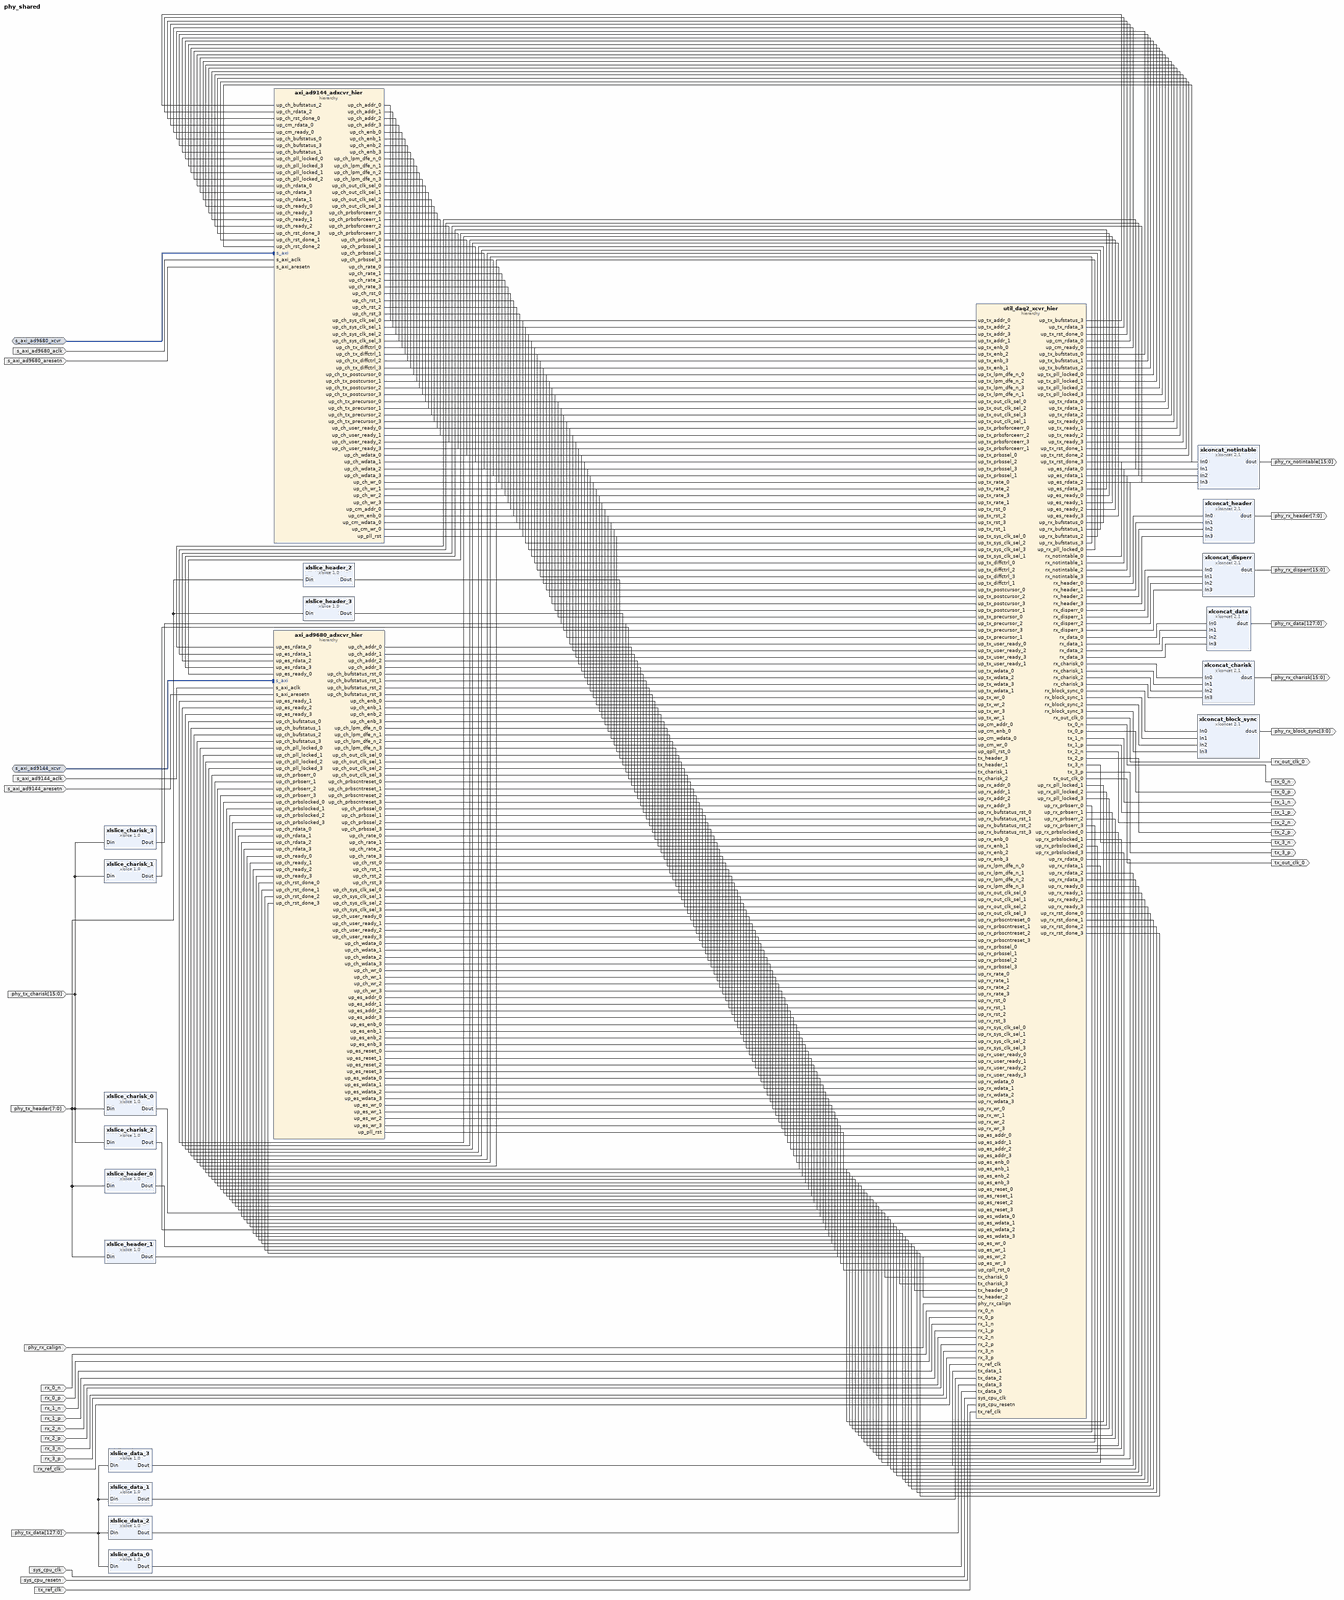
[diagram p0: block diagram of the top level, whole]
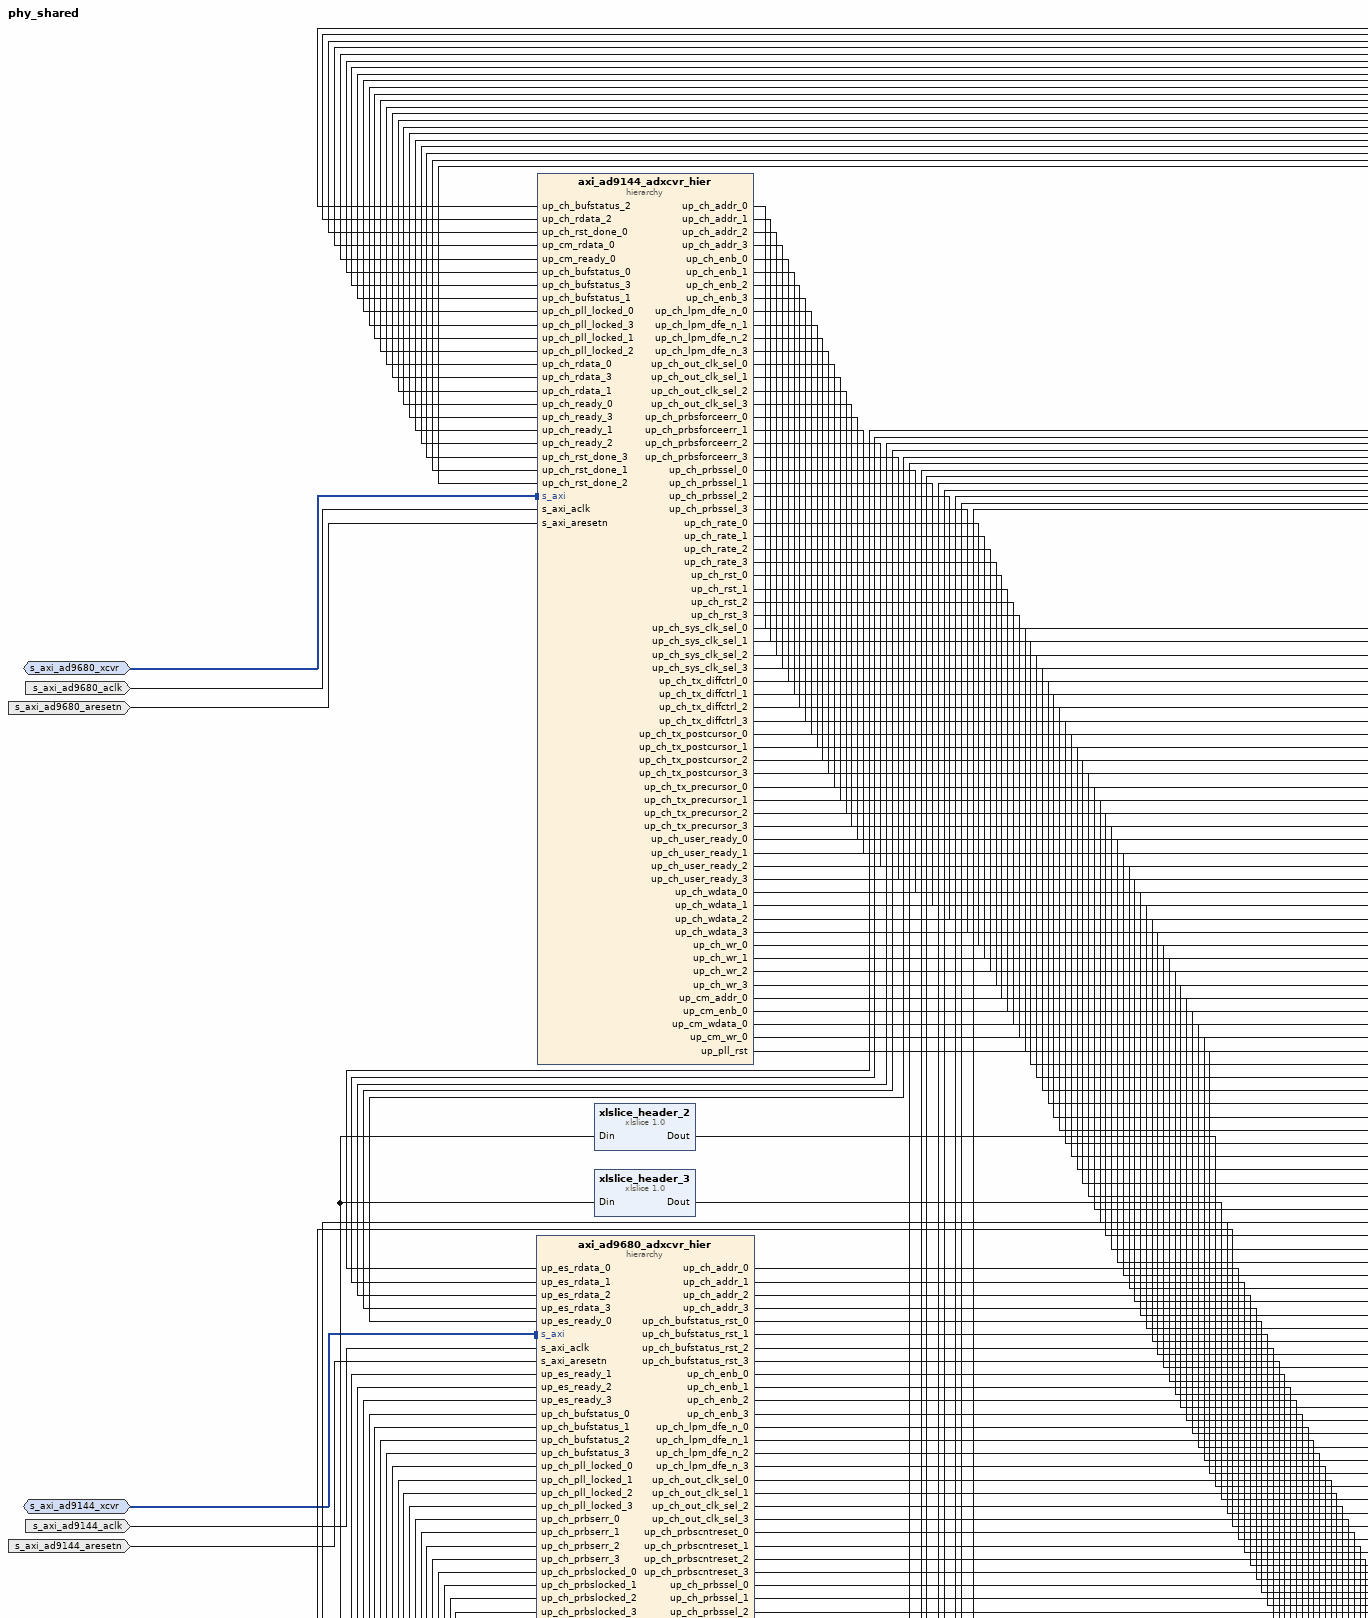
[diagram p1: block diagram of the top level, upper left part]
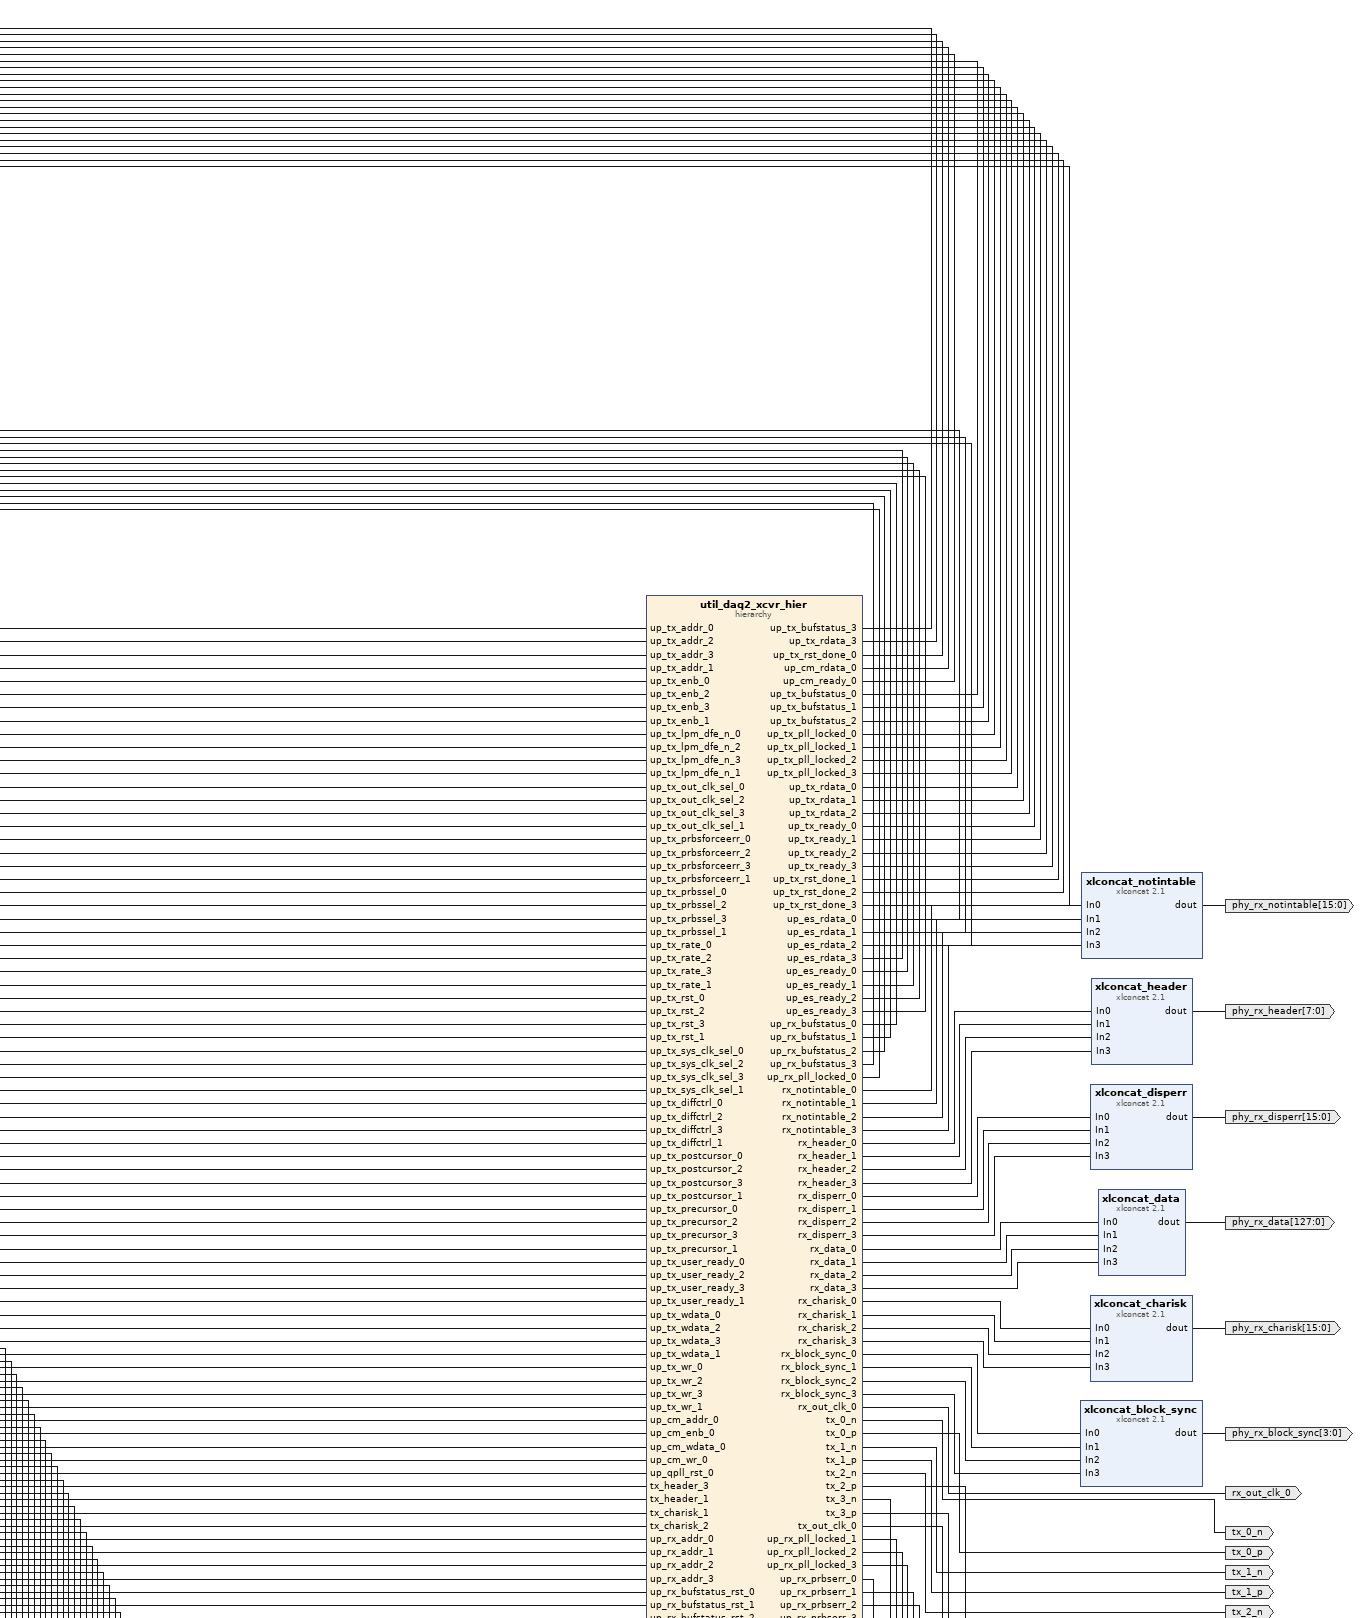
[diagram p2: block diagram of the top level, upper right part]
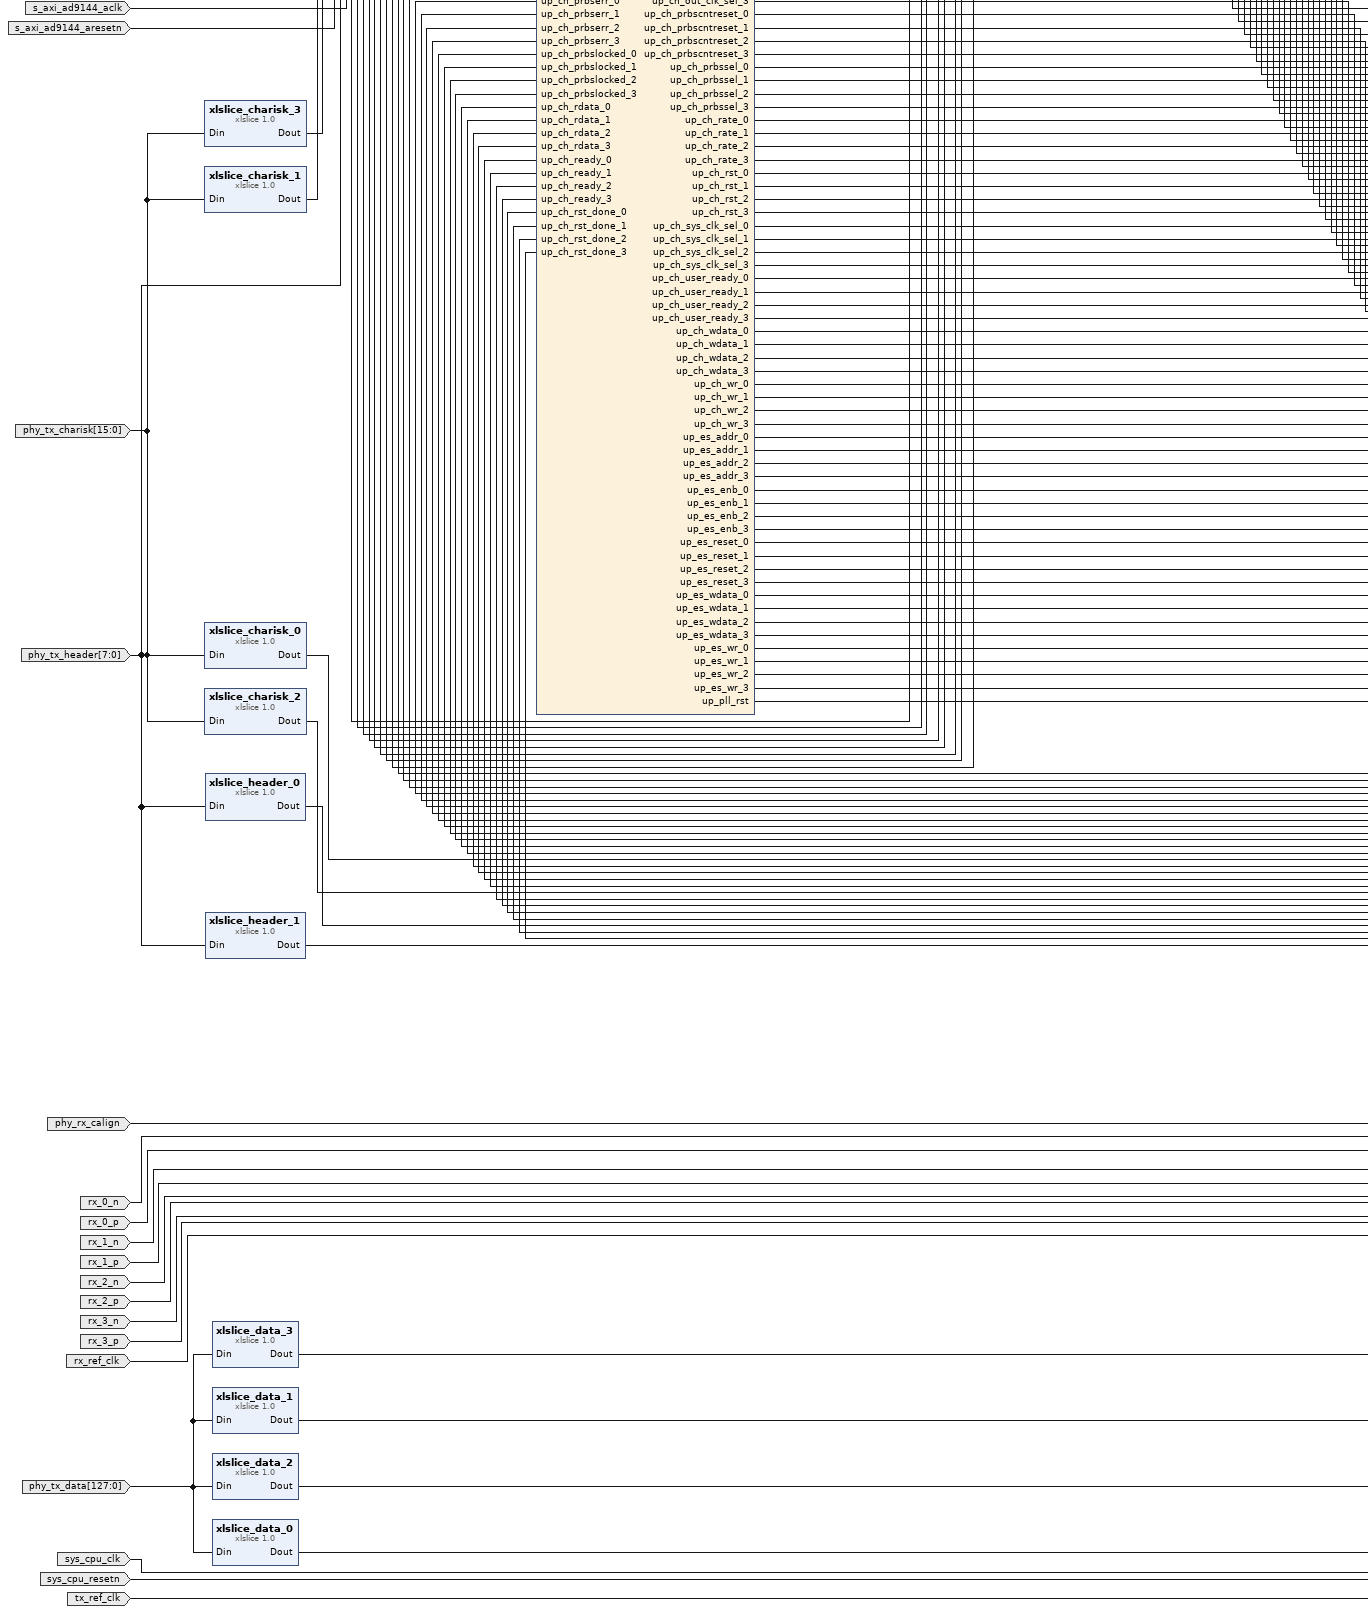
[diagram p3: block diagram of the top level, lower left part]
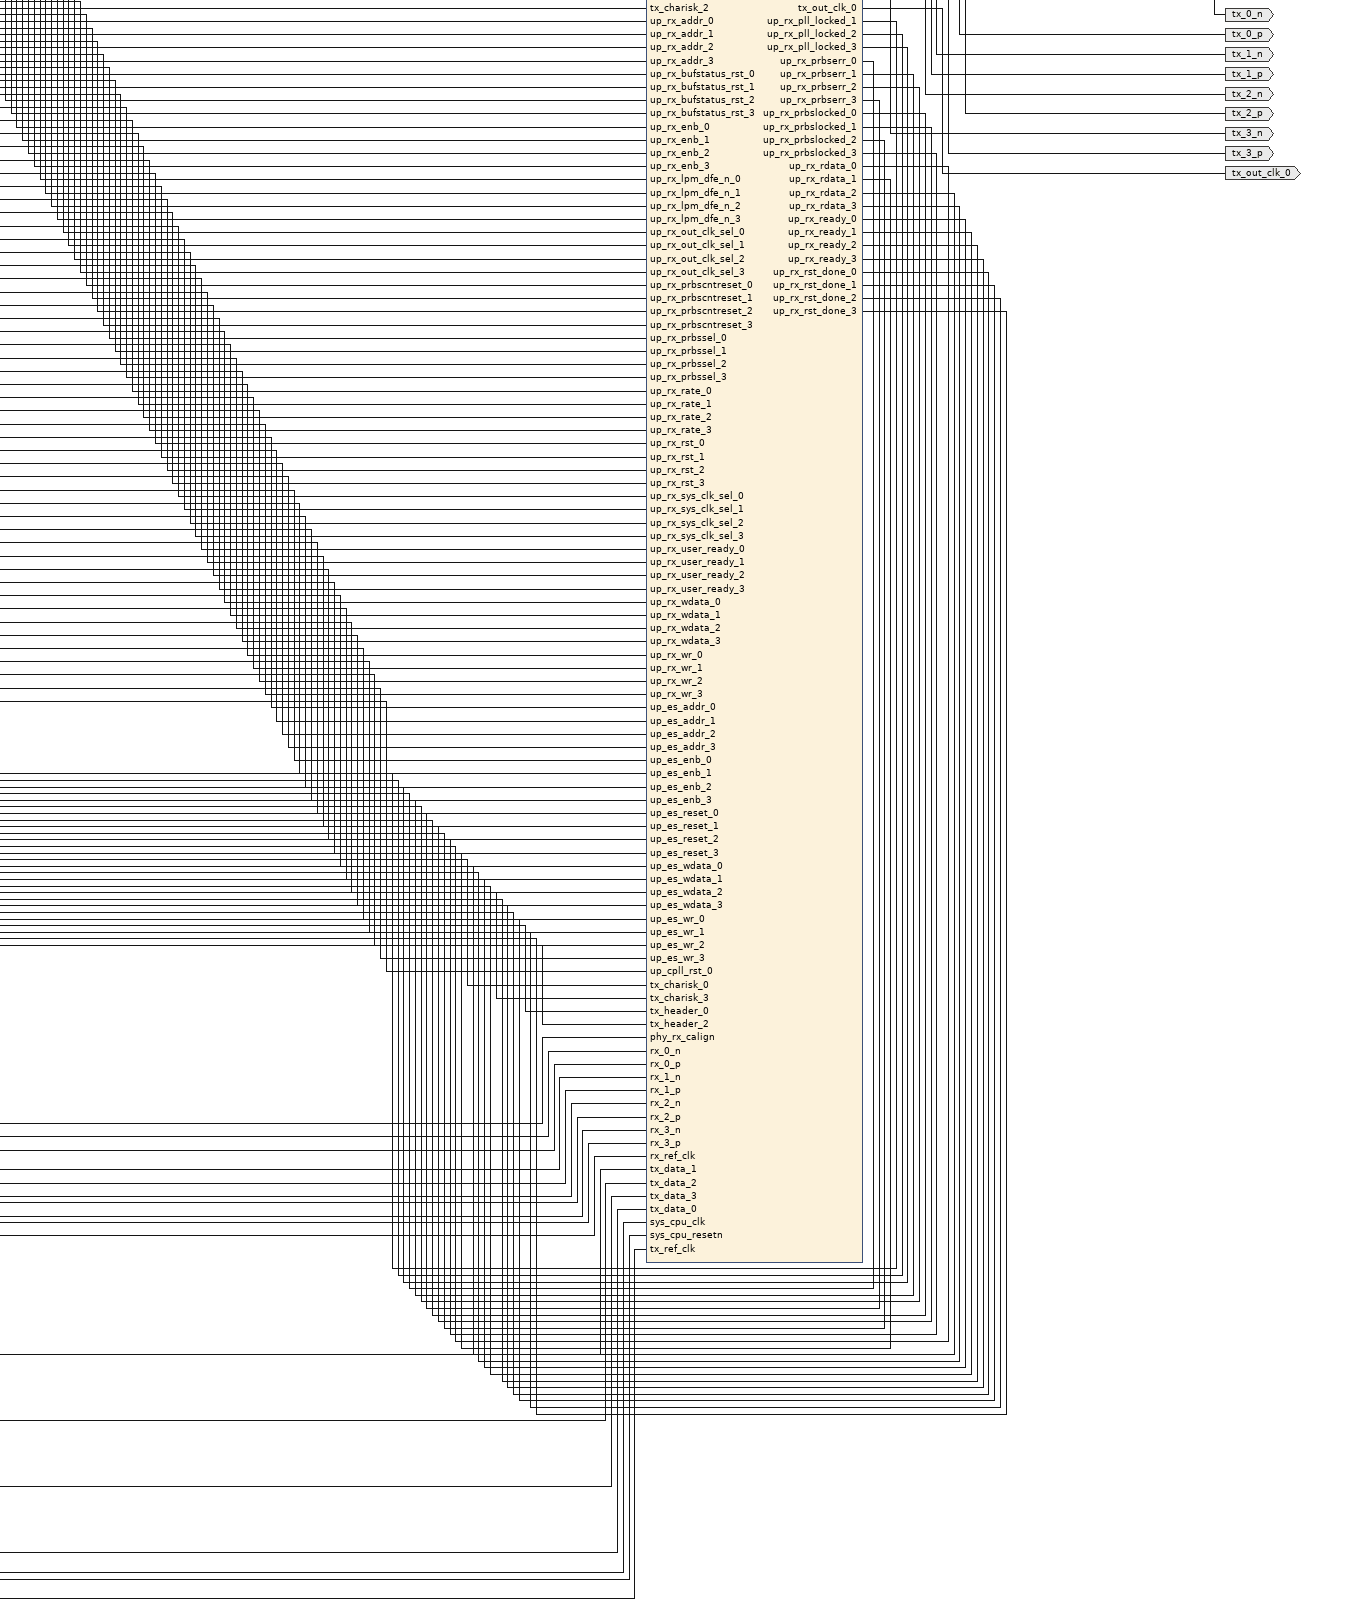
[diagram p4: block diagram of the top level, lower right part]
# Vivado block design phy_shared, xczu7ev-fbvb900-1-e, Vivado 2022.2
create_bd_design phy_shared

create_bd_intf_port -mode Slave -vlnv xilinx.com:interface:aximm_rtl:1.0 s_axi_ad9144_xcvr
set_property -dict [list \
  CONFIG.ADDR_WIDTH 16 \
  CONFIG.ARUSER_WIDTH 0 \
  CONFIG.AWUSER_WIDTH 0 \
  CONFIG.BUSER_WIDTH 0 \
  CONFIG.DATA_WIDTH 32 \
  CONFIG.HAS_BRESP 1 \
  CONFIG.HAS_BURST 0 \
  CONFIG.HAS_CACHE 0 \
  CONFIG.HAS_LOCK 0 \
  CONFIG.HAS_PROT 1 \
  CONFIG.HAS_QOS 0 \
  CONFIG.HAS_REGION 0 \
  CONFIG.HAS_RRESP 1 \
  CONFIG.HAS_WSTRB 1 \
  CONFIG.ID_WIDTH 0 \
  CONFIG.MAX_BURST_LENGTH 1 \
  CONFIG.NUM_READ_OUTSTANDING 1 \
  CONFIG.NUM_READ_THREADS 1 \
  CONFIG.NUM_WRITE_OUTSTANDING 1 \
  CONFIG.NUM_WRITE_THREADS 1 \
  CONFIG.PROTOCOL AXI4LITE \
  CONFIG.READ_WRITE_MODE READ_WRITE \
  CONFIG.RUSER_BITS_PER_BYTE 0 \
  CONFIG.RUSER_WIDTH 0 \
  CONFIG.SUPPORTS_NARROW_BURST 0 \
  CONFIG.WUSER_BITS_PER_BYTE 0 \
  CONFIG.WUSER_WIDTH 0 \
] [get_bd_intf_ports s_axi_ad9144_xcvr]
create_bd_intf_port -mode Slave -vlnv xilinx.com:interface:aximm_rtl:1.0 s_axi_ad9680_xcvr
set_property -dict [list \
  CONFIG.ADDR_WIDTH 16 \
  CONFIG.ARUSER_WIDTH 0 \
  CONFIG.AWUSER_WIDTH 0 \
  CONFIG.BUSER_WIDTH 0 \
  CONFIG.DATA_WIDTH 32 \
  CONFIG.HAS_BRESP 1 \
  CONFIG.HAS_BURST 0 \
  CONFIG.HAS_CACHE 0 \
  CONFIG.HAS_LOCK 0 \
  CONFIG.HAS_PROT 1 \
  CONFIG.HAS_QOS 0 \
  CONFIG.HAS_REGION 0 \
  CONFIG.HAS_RRESP 1 \
  CONFIG.HAS_WSTRB 1 \
  CONFIG.ID_WIDTH 0 \
  CONFIG.MAX_BURST_LENGTH 1 \
  CONFIG.NUM_READ_OUTSTANDING 1 \
  CONFIG.NUM_READ_THREADS 1 \
  CONFIG.NUM_WRITE_OUTSTANDING 1 \
  CONFIG.NUM_WRITE_THREADS 1 \
  CONFIG.PROTOCOL AXI4LITE \
  CONFIG.READ_WRITE_MODE READ_WRITE \
  CONFIG.RUSER_BITS_PER_BYTE 0 \
  CONFIG.RUSER_WIDTH 0 \
  CONFIG.SUPPORTS_NARROW_BURST 0 \
  CONFIG.WUSER_BITS_PER_BYTE 0 \
  CONFIG.WUSER_WIDTH 0 \
] [get_bd_intf_ports s_axi_ad9680_xcvr]
create_bd_port -dir O rx_out_clk_0
create_bd_port -dir O tx_out_clk_0
create_bd_port -dir I sys_cpu_resetn
create_bd_port -dir I sys_cpu_clk
create_bd_port -dir I tx_ref_clk
create_bd_port -dir I rx_ref_clk
create_bd_port -dir I rx_0_p
create_bd_port -dir I rx_0_n
create_bd_port -dir I phy_rx_calign
create_bd_port -dir O tx_0_p
create_bd_port -dir O tx_0_n
create_bd_port -dir O tx_1_p
create_bd_port -dir O tx_1_n
create_bd_port -dir O tx_3_p
create_bd_port -dir O tx_3_n
create_bd_port -dir O tx_2_p
create_bd_port -dir O tx_2_n
create_bd_port -dir I rx_3_p
create_bd_port -dir I rx_3_n
create_bd_port -dir I rx_2_p
create_bd_port -dir I rx_2_n
create_bd_port -dir I rx_1_p
create_bd_port -dir I rx_1_n
create_bd_port -dir O -from 15 -to 0 phy_rx_charisk
create_bd_port -dir O -from 127 -to 0 phy_rx_data
create_bd_port -dir O -from 15 -to 0 phy_rx_disperr
create_bd_port -dir O -from 15 -to 0 phy_rx_notintable
create_bd_port -dir O -from 3 -to 0 phy_rx_block_sync
create_bd_port -dir O -from 7 -to 0 phy_rx_header
create_bd_port -dir I s_axi_ad9144_aclk
create_bd_port -dir I s_axi_ad9144_aresetn
create_bd_port -dir I s_axi_ad9680_aclk
create_bd_port -dir I s_axi_ad9680_aresetn
create_bd_port -dir I -from 15 -to 0 phy_tx_charisk
create_bd_port -dir I -from 7 -to 0 phy_tx_header
create_bd_port -dir I -from 127 -to 0 phy_tx_data

create_bd_cell -type hier axi_ad9144_adxcvr_hier
create_bd_cell -type hier axi_ad9680_adxcvr_hier
create_bd_cell -type hier util_daq2_xcvr_hier
create_bd_cell -type ip -vlnv xilinx.com:ip:xlconcat:2.1 xlconcat_charisk
set_property -dict {CONFIG.NUM_PORTS 4} [get_bd_cells xlconcat_charisk]
create_bd_cell -type ip -vlnv xilinx.com:ip:xlconcat:2.1 xlconcat_data
set_property -dict {CONFIG.NUM_PORTS 4} [get_bd_cells xlconcat_data]
create_bd_cell -type ip -vlnv xilinx.com:ip:xlconcat:2.1 xlconcat_disperr
set_property -dict {CONFIG.NUM_PORTS 4} [get_bd_cells xlconcat_disperr]
create_bd_cell -type ip -vlnv xilinx.com:ip:xlconcat:2.1 xlconcat_notintable
set_property -dict {CONFIG.NUM_PORTS 4} [get_bd_cells xlconcat_notintable]
create_bd_cell -type ip -vlnv xilinx.com:ip:xlconcat:2.1 xlconcat_block_sync
set_property -dict {CONFIG.NUM_PORTS 4} [get_bd_cells xlconcat_block_sync]
create_bd_cell -type ip -vlnv xilinx.com:ip:xlconcat:2.1 xlconcat_header
set_property -dict {CONFIG.NUM_PORTS 4} [get_bd_cells xlconcat_header]
create_bd_cell -type ip -vlnv xilinx.com:ip:xlslice:1.0 xlslice_charisk_0
set_property -dict {CONFIG.DIN_FROM 3 CONFIG.DIN_WIDTH 16} [get_bd_cells xlslice_charisk_0]
create_bd_cell -type ip -vlnv xilinx.com:ip:xlslice:1.0 xlslice_charisk_1
set_property -dict {CONFIG.DIN_FROM 7 CONFIG.DIN_TO 4 CONFIG.DIN_WIDTH 16} [get_bd_cells xlslice_charisk_1]
create_bd_cell -type ip -vlnv xilinx.com:ip:xlslice:1.0 xlslice_charisk_2
set_property -dict {CONFIG.DIN_FROM 11 CONFIG.DIN_TO 8 CONFIG.DIN_WIDTH 16} [get_bd_cells xlslice_charisk_2]
create_bd_cell -type ip -vlnv xilinx.com:ip:xlslice:1.0 xlslice_charisk_3
set_property -dict {CONFIG.DIN_FROM 15 CONFIG.DIN_TO 12 CONFIG.DIN_WIDTH 16} [get_bd_cells xlslice_charisk_3]
create_bd_cell -type ip -vlnv xilinx.com:ip:xlslice:1.0 xlslice_header_0
set_property -dict {CONFIG.DIN_FROM 1 CONFIG.DIN_WIDTH 8} [get_bd_cells xlslice_header_0]
create_bd_cell -type ip -vlnv xilinx.com:ip:xlslice:1.0 xlslice_header_1
set_property -dict {CONFIG.DIN_FROM 3 CONFIG.DIN_TO 2 CONFIG.DIN_WIDTH 8} [get_bd_cells xlslice_header_1]
create_bd_cell -type ip -vlnv xilinx.com:ip:xlslice:1.0 xlslice_header_2
set_property -dict {CONFIG.DIN_FROM 5 CONFIG.DIN_TO 4 CONFIG.DIN_WIDTH 8} [get_bd_cells xlslice_header_2]
create_bd_cell -type ip -vlnv xilinx.com:ip:xlslice:1.0 xlslice_header_3
set_property -dict {CONFIG.DIN_FROM 7 CONFIG.DIN_TO 6 CONFIG.DIN_WIDTH 8} [get_bd_cells xlslice_header_3]
create_bd_cell -type ip -vlnv xilinx.com:ip:xlslice:1.0 xlslice_data_0
set_property -dict {CONFIG.DIN_FROM 31 CONFIG.DIN_WIDTH 128} [get_bd_cells xlslice_data_0]
create_bd_cell -type ip -vlnv xilinx.com:ip:xlslice:1.0 xlslice_data_1
set_property -dict {CONFIG.DIN_FROM 31 CONFIG.DIN_WIDTH 128} [get_bd_cells xlslice_data_1]
create_bd_cell -type ip -vlnv xilinx.com:ip:xlslice:1.0 xlslice_data_2
set_property -dict {CONFIG.DIN_FROM 31 CONFIG.DIN_WIDTH 128} [get_bd_cells xlslice_data_2]
create_bd_cell -type ip -vlnv xilinx.com:ip:xlslice:1.0 xlslice_data_3
set_property -dict {CONFIG.DIN_FROM 31 CONFIG.DIN_WIDTH 128} [get_bd_cells xlslice_data_3]

# ---- hierarchy /axi_ad9144_adxcvr_hier ----
current_bd_instance /axi_ad9144_adxcvr_hier
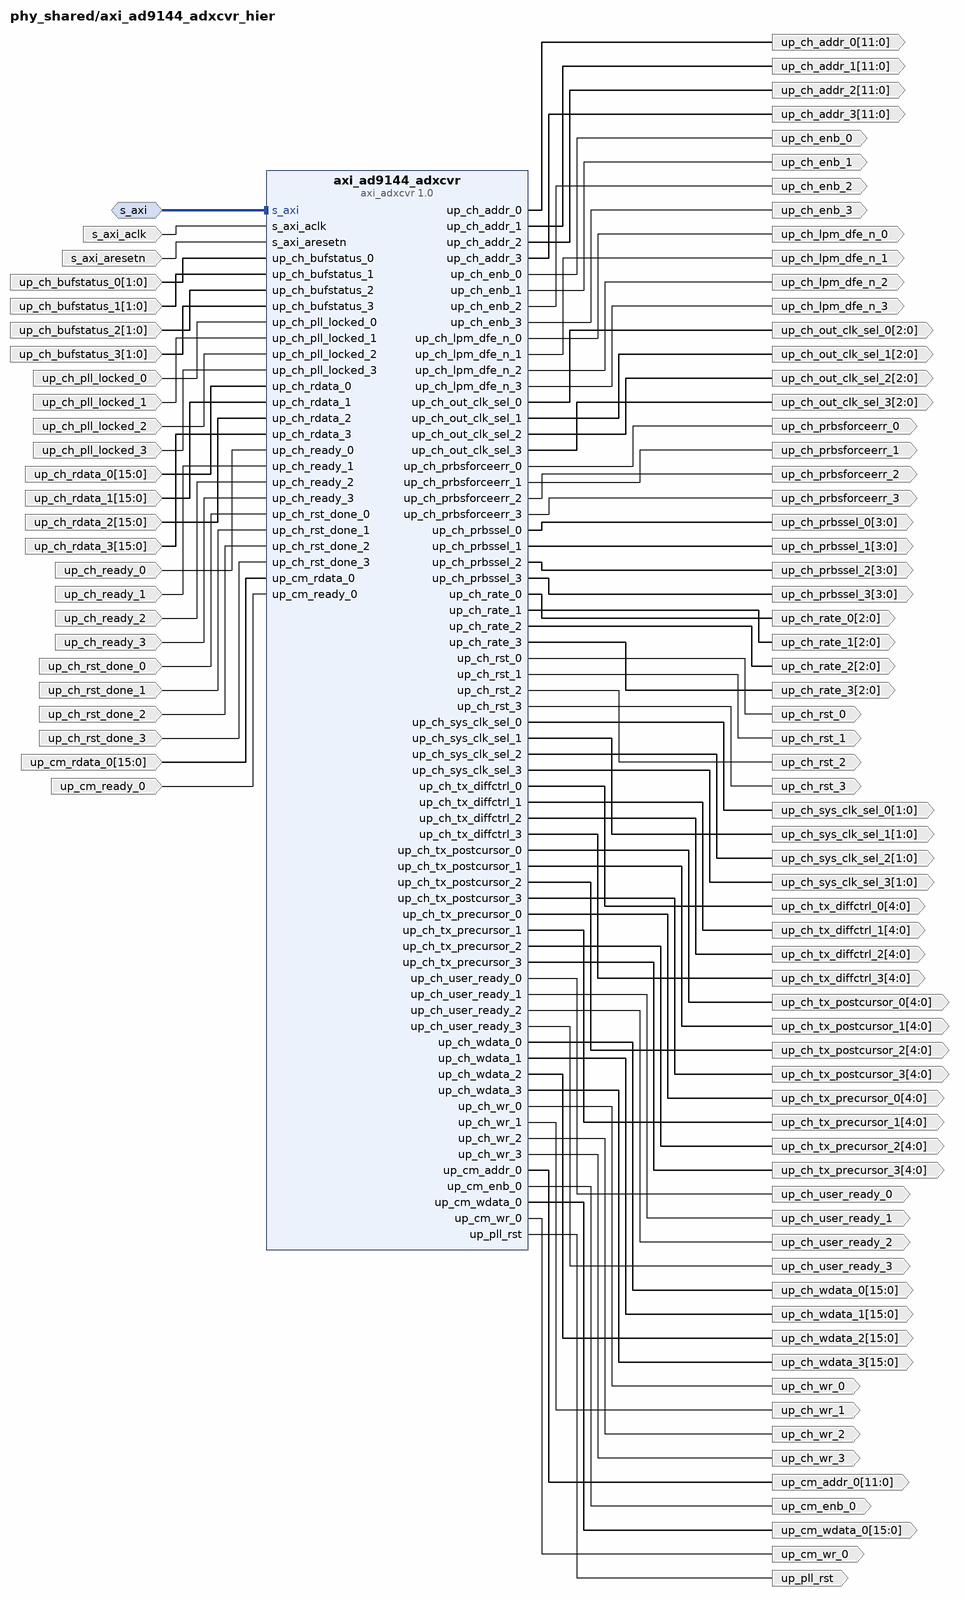
[diagram p5: block diagram inside /axi_ad9144_adxcvr_hier]
create_bd_intf_pin -mode Slave -vlnv xilinx.com:interface:aximm_rtl:1.0 s_axi
create_bd_pin -dir I up_ch_rst_done_0
create_bd_pin -dir I up_ch_pll_locked_0
create_bd_pin -dir I -from 1 -to 0 up_ch_bufstatus_0
create_bd_pin -dir I -from 15 -to 0 up_ch_rdata_0
create_bd_pin -dir I up_ch_ready_0
create_bd_pin -dir I up_ch_pll_locked_3
create_bd_pin -dir I up_ch_rst_done_3
create_bd_pin -dir I -from 1 -to 0 up_ch_bufstatus_3
create_bd_pin -dir I -from 15 -to 0 up_ch_rdata_3
create_bd_pin -dir I up_ch_ready_3
create_bd_pin -dir I up_ch_pll_locked_1
create_bd_pin -dir I up_ch_rst_done_1
create_bd_pin -dir I -from 1 -to 0 up_ch_bufstatus_1
create_bd_pin -dir I -from 15 -to 0 up_ch_rdata_1
create_bd_pin -dir I up_ch_ready_1
create_bd_pin -dir I up_ch_pll_locked_2
create_bd_pin -dir I -from 1 -to 0 up_ch_bufstatus_2
create_bd_pin -dir I -from 15 -to 0 up_ch_rdata_2
create_bd_pin -dir I up_ch_rst_done_2
create_bd_pin -dir I up_ch_ready_2
create_bd_pin -dir I -from 15 -to 0 up_cm_rdata_0
create_bd_pin -dir I up_cm_ready_0
create_bd_pin -dir I s_axi_aclk
create_bd_pin -dir I s_axi_aresetn
create_bd_pin -dir O up_cm_enb_0
create_bd_pin -dir O -from 11 -to 0 up_cm_addr_0
create_bd_pin -dir O up_cm_wr_0
create_bd_pin -dir O -from 15 -to 0 up_cm_wdata_0
create_bd_pin -dir O up_ch_rst_0
create_bd_pin -dir O up_ch_user_ready_0
create_bd_pin -dir O up_ch_prbsforceerr_0
create_bd_pin -dir O -from 3 -to 0 up_ch_prbssel_0
create_bd_pin -dir O up_ch_lpm_dfe_n_0
create_bd_pin -dir O -from 2 -to 0 up_ch_rate_0
create_bd_pin -dir O -from 1 -to 0 up_ch_sys_clk_sel_0
create_bd_pin -dir O -from 2 -to 0 up_ch_out_clk_sel_0
create_bd_pin -dir O -from 4 -to 0 up_ch_tx_diffctrl_0
create_bd_pin -dir O -from 4 -to 0 up_ch_tx_postcursor_0
create_bd_pin -dir O -from 4 -to 0 up_ch_tx_precursor_0
create_bd_pin -dir O up_ch_enb_0
create_bd_pin -dir O -from 11 -to 0 up_ch_addr_0
create_bd_pin -dir O up_ch_wr_0
create_bd_pin -dir O -from 15 -to 0 up_ch_wdata_0
create_bd_pin -dir O up_ch_rst_1
create_bd_pin -dir O up_ch_user_ready_1
create_bd_pin -dir O up_ch_prbsforceerr_1
create_bd_pin -dir O -from 3 -to 0 up_ch_prbssel_1
create_bd_pin -dir O up_ch_lpm_dfe_n_1
create_bd_pin -dir O -from 2 -to 0 up_ch_rate_1
create_bd_pin -dir O -from 1 -to 0 up_ch_sys_clk_sel_1
create_bd_pin -dir O -from 2 -to 0 up_ch_out_clk_sel_1
create_bd_pin -dir O -from 4 -to 0 up_ch_tx_diffctrl_1
create_bd_pin -dir O -from 4 -to 0 up_ch_tx_postcursor_1
create_bd_pin -dir O -from 4 -to 0 up_ch_tx_precursor_1
create_bd_pin -dir O up_ch_enb_1
create_bd_pin -dir O -from 11 -to 0 up_ch_addr_1
create_bd_pin -dir O up_ch_wr_1
create_bd_pin -dir O -from 15 -to 0 up_ch_wdata_1
create_bd_pin -dir O up_ch_rst_2
create_bd_pin -dir O up_ch_user_ready_2
create_bd_pin -dir O up_ch_prbsforceerr_2
create_bd_pin -dir O -from 3 -to 0 up_ch_prbssel_2
create_bd_pin -dir O up_ch_lpm_dfe_n_2
create_bd_pin -dir O -from 2 -to 0 up_ch_rate_2
create_bd_pin -dir O -from 1 -to 0 up_ch_sys_clk_sel_2
create_bd_pin -dir O -from 2 -to 0 up_ch_out_clk_sel_2
create_bd_pin -dir O -from 4 -to 0 up_ch_tx_diffctrl_2
create_bd_pin -dir O -from 4 -to 0 up_ch_tx_postcursor_2
create_bd_pin -dir O -from 4 -to 0 up_ch_tx_precursor_2
create_bd_pin -dir O up_ch_enb_2
create_bd_pin -dir O -from 11 -to 0 up_ch_addr_2
create_bd_pin -dir O up_ch_wr_2
create_bd_pin -dir O -from 15 -to 0 up_ch_wdata_2
create_bd_pin -dir O up_ch_rst_3
create_bd_pin -dir O up_ch_user_ready_3
create_bd_pin -dir O up_ch_prbsforceerr_3
create_bd_pin -dir O -from 3 -to 0 up_ch_prbssel_3
create_bd_pin -dir O up_ch_lpm_dfe_n_3
create_bd_pin -dir O -from 2 -to 0 up_ch_rate_3
create_bd_pin -dir O -from 1 -to 0 up_ch_sys_clk_sel_3
create_bd_pin -dir O -from 2 -to 0 up_ch_out_clk_sel_3
create_bd_pin -dir O -from 4 -to 0 up_ch_tx_diffctrl_3
create_bd_pin -dir O -from 4 -to 0 up_ch_tx_postcursor_3
create_bd_pin -dir O -from 4 -to 0 up_ch_tx_precursor_3
create_bd_pin -dir O up_ch_enb_3
create_bd_pin -dir O -from 11 -to 0 up_ch_addr_3
create_bd_pin -dir O up_ch_wr_3
create_bd_pin -dir O -from 15 -to 0 up_ch_wdata_3
create_bd_pin -dir O -type rst up_pll_rst

create_bd_cell -type ip -vlnv analog.devices:user:axi_adxcvr:1.0 axi_ad9144_adxcvr
set_property -dict {CONFIG.ID 1 CONFIG.NUM_OF_LANES 4 CONFIG.TX_OR_RX_N 1 CONFIG.XCVR_TYPE 8} [get_bd_cells axi_ad9144_adxcvr]

# ---- hierarchy /axi_ad9680_adxcvr_hier ----
current_bd_instance /axi_ad9680_adxcvr_hier
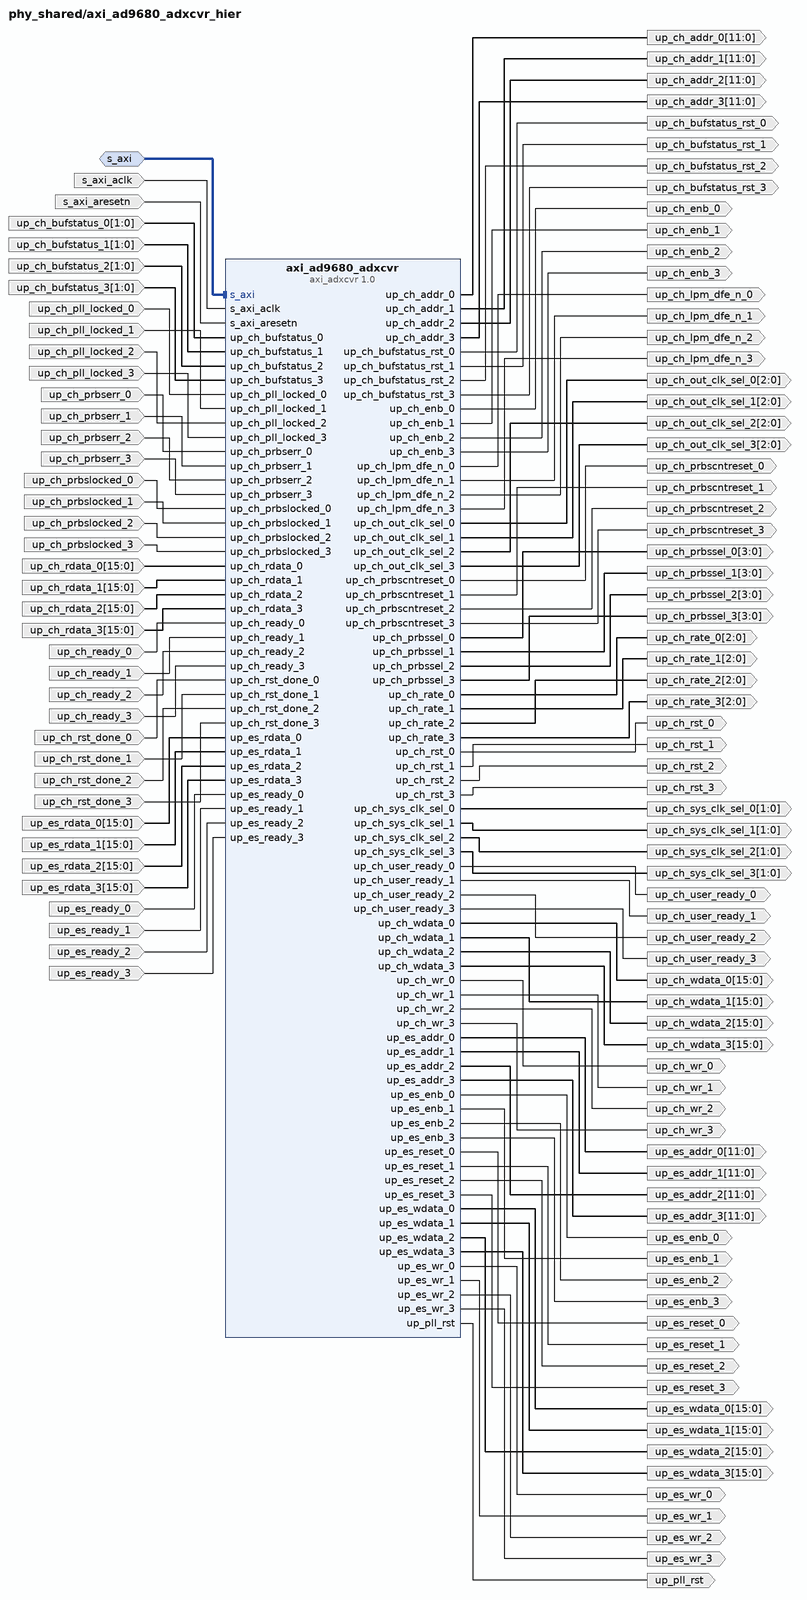
[diagram p6: block diagram inside /axi_ad9680_adxcvr_hier]
create_bd_intf_pin -mode Slave -vlnv xilinx.com:interface:aximm_rtl:1.0 s_axi
create_bd_pin -dir I up_ch_ready_3
create_bd_pin -dir I -from 15 -to 0 up_ch_rdata_3
create_bd_pin -dir I up_ch_ready_2
create_bd_pin -dir I up_ch_ready_1
create_bd_pin -dir I -from 15 -to 0 up_es_rdata_0
create_bd_pin -dir I up_ch_pll_locked_0
create_bd_pin -dir I up_ch_prbserr_0
create_bd_pin -dir I up_es_ready_0
create_bd_pin -dir I up_ch_rst_done_0
create_bd_pin -dir I up_ch_prbslocked_0
create_bd_pin -dir I -from 1 -to 0 up_ch_bufstatus_0
create_bd_pin -dir I -from 15 -to 0 up_ch_rdata_0
create_bd_pin -dir I up_ch_ready_0
create_bd_pin -dir I -from 15 -to 0 up_es_rdata_1
create_bd_pin -dir I up_es_ready_1
create_bd_pin -dir I up_ch_pll_locked_1
create_bd_pin -dir I up_ch_rst_done_1
create_bd_pin -dir I up_ch_prbserr_1
create_bd_pin -dir I up_ch_prbslocked_1
create_bd_pin -dir I -from 1 -to 0 up_ch_bufstatus_1
create_bd_pin -dir I -from 15 -to 0 up_ch_rdata_1
create_bd_pin -dir I -from 15 -to 0 up_es_rdata_2
create_bd_pin -dir I up_es_ready_2
create_bd_pin -dir I up_ch_pll_locked_2
create_bd_pin -dir I up_ch_rst_done_2
create_bd_pin -dir I up_ch_prbserr_2
create_bd_pin -dir I up_ch_prbslocked_2
create_bd_pin -dir I -from 15 -to 0 up_ch_rdata_2
create_bd_pin -dir I -from 15 -to 0 up_es_rdata_3
create_bd_pin -dir I up_es_ready_3
create_bd_pin -dir I up_ch_pll_locked_3
create_bd_pin -dir I up_ch_rst_done_3
create_bd_pin -dir I up_ch_prbserr_3
create_bd_pin -dir I up_ch_prbslocked_3
create_bd_pin -dir I -from 1 -to 0 up_ch_bufstatus_3
create_bd_pin -dir I -from 1 -to 0 up_ch_bufstatus_2
create_bd_pin -dir I s_axi_aclk
create_bd_pin -dir I s_axi_aresetn
create_bd_pin -dir O up_es_enb_0
create_bd_pin -dir O -from 11 -to 0 up_es_addr_0
create_bd_pin -dir O up_es_wr_0
create_bd_pin -dir O up_es_reset_0
create_bd_pin -dir O -from 15 -to 0 up_es_wdata_0
create_bd_pin -dir O up_ch_rst_0
create_bd_pin -dir O up_ch_user_ready_0
create_bd_pin -dir O -from 3 -to 0 up_ch_prbssel_0
create_bd_pin -dir O up_ch_prbscntreset_0
create_bd_pin -dir O up_ch_bufstatus_rst_0
create_bd_pin -dir O up_ch_lpm_dfe_n_0
create_bd_pin -dir O -from 2 -to 0 up_ch_rate_0
create_bd_pin -dir O -from 1 -to 0 up_ch_sys_clk_sel_0
create_bd_pin -dir O -from 2 -to 0 up_ch_out_clk_sel_0
create_bd_pin -dir O up_ch_enb_0
create_bd_pin -dir O -from 11 -to 0 up_ch_addr_0
create_bd_pin -dir O up_ch_wr_0
create_bd_pin -dir O -from 15 -to 0 up_ch_wdata_0
create_bd_pin -dir O up_es_enb_1
create_bd_pin -dir O -from 11 -to 0 up_es_addr_1
create_bd_pin -dir O up_es_wr_1
create_bd_pin -dir O up_es_reset_1
create_bd_pin -dir O -from 15 -to 0 up_es_wdata_1
create_bd_pin -dir O up_ch_rst_1
create_bd_pin -dir O up_ch_user_ready_1
create_bd_pin -dir O -from 3 -to 0 up_ch_prbssel_1
create_bd_pin -dir O up_ch_prbscntreset_1
create_bd_pin -dir O up_ch_bufstatus_rst_1
create_bd_pin -dir O up_ch_lpm_dfe_n_1
create_bd_pin -dir O -from 2 -to 0 up_ch_rate_1
create_bd_pin -dir O -from 1 -to 0 up_ch_sys_clk_sel_1
create_bd_pin -dir O -from 2 -to 0 up_ch_out_clk_sel_1
create_bd_pin -dir O up_ch_enb_1
create_bd_pin -dir O -from 11 -to 0 up_ch_addr_1
create_bd_pin -dir O up_ch_wr_1
create_bd_pin -dir O -from 15 -to 0 up_ch_wdata_1
create_bd_pin -dir O up_es_enb_2
create_bd_pin -dir O -from 11 -to 0 up_es_addr_2
create_bd_pin -dir O up_es_wr_2
create_bd_pin -dir O up_es_reset_2
create_bd_pin -dir O -from 15 -to 0 up_es_wdata_2
create_bd_pin -dir O up_ch_rst_2
create_bd_pin -dir O up_ch_user_ready_2
create_bd_pin -dir O -from 3 -to 0 up_ch_prbssel_2
create_bd_pin -dir O up_ch_prbscntreset_2
create_bd_pin -dir O up_ch_bufstatus_rst_2
create_bd_pin -dir O up_ch_lpm_dfe_n_2
create_bd_pin -dir O -from 2 -to 0 up_ch_rate_2
create_bd_pin -dir O -from 1 -to 0 up_ch_sys_clk_sel_2
create_bd_pin -dir O -from 2 -to 0 up_ch_out_clk_sel_2
create_bd_pin -dir O up_ch_enb_2
create_bd_pin -dir O -from 11 -to 0 up_ch_addr_2
create_bd_pin -dir O up_ch_wr_2
create_bd_pin -dir O -from 15 -to 0 up_ch_wdata_2
create_bd_pin -dir O up_es_enb_3
create_bd_pin -dir O -from 11 -to 0 up_es_addr_3
create_bd_pin -dir O up_es_wr_3
create_bd_pin -dir O up_es_reset_3
create_bd_pin -dir O -from 15 -to 0 up_es_wdata_3
create_bd_pin -dir O up_ch_rst_3
create_bd_pin -dir O up_ch_user_ready_3
create_bd_pin -dir O -from 3 -to 0 up_ch_prbssel_3
create_bd_pin -dir O up_ch_prbscntreset_3
create_bd_pin -dir O up_ch_bufstatus_rst_3
create_bd_pin -dir O up_ch_lpm_dfe_n_3
create_bd_pin -dir O -from 2 -to 0 up_ch_rate_3
create_bd_pin -dir O -from 1 -to 0 up_ch_sys_clk_sel_3
create_bd_pin -dir O -from 2 -to 0 up_ch_out_clk_sel_3
create_bd_pin -dir O up_ch_enb_3
create_bd_pin -dir O -from 11 -to 0 up_ch_addr_3
create_bd_pin -dir O up_ch_wr_3
create_bd_pin -dir O -from 15 -to 0 up_ch_wdata_3
create_bd_pin -dir O -type rst up_pll_rst

create_bd_cell -type ip -vlnv analog.devices:user:axi_adxcvr:1.0 axi_ad9680_adxcvr
set_property -dict {CONFIG.NUM_OF_LANES 4 CONFIG.QPLL_ENABLE 0 CONFIG.XCVR_TYPE 8} [get_bd_cells axi_ad9680_adxcvr]

# ---- hierarchy /util_daq2_xcvr_hier ----
current_bd_instance /util_daq2_xcvr_hier
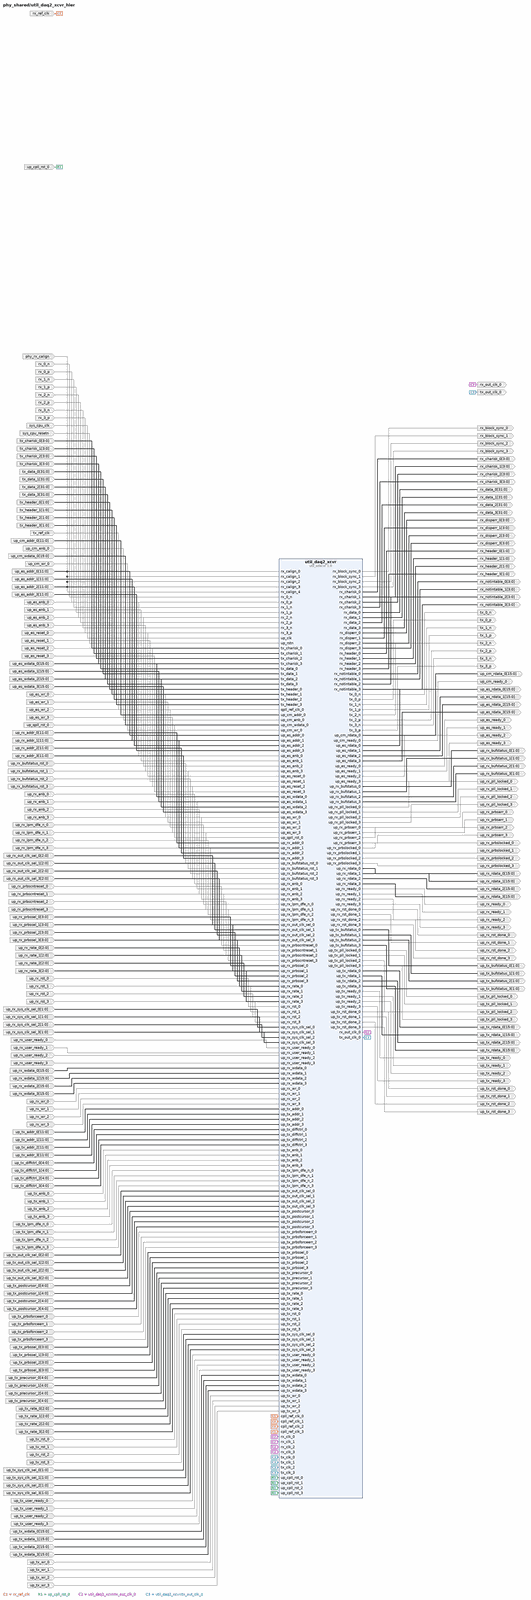
[diagram p7: block diagram inside /util_daq2_xcvr_hier, whole]
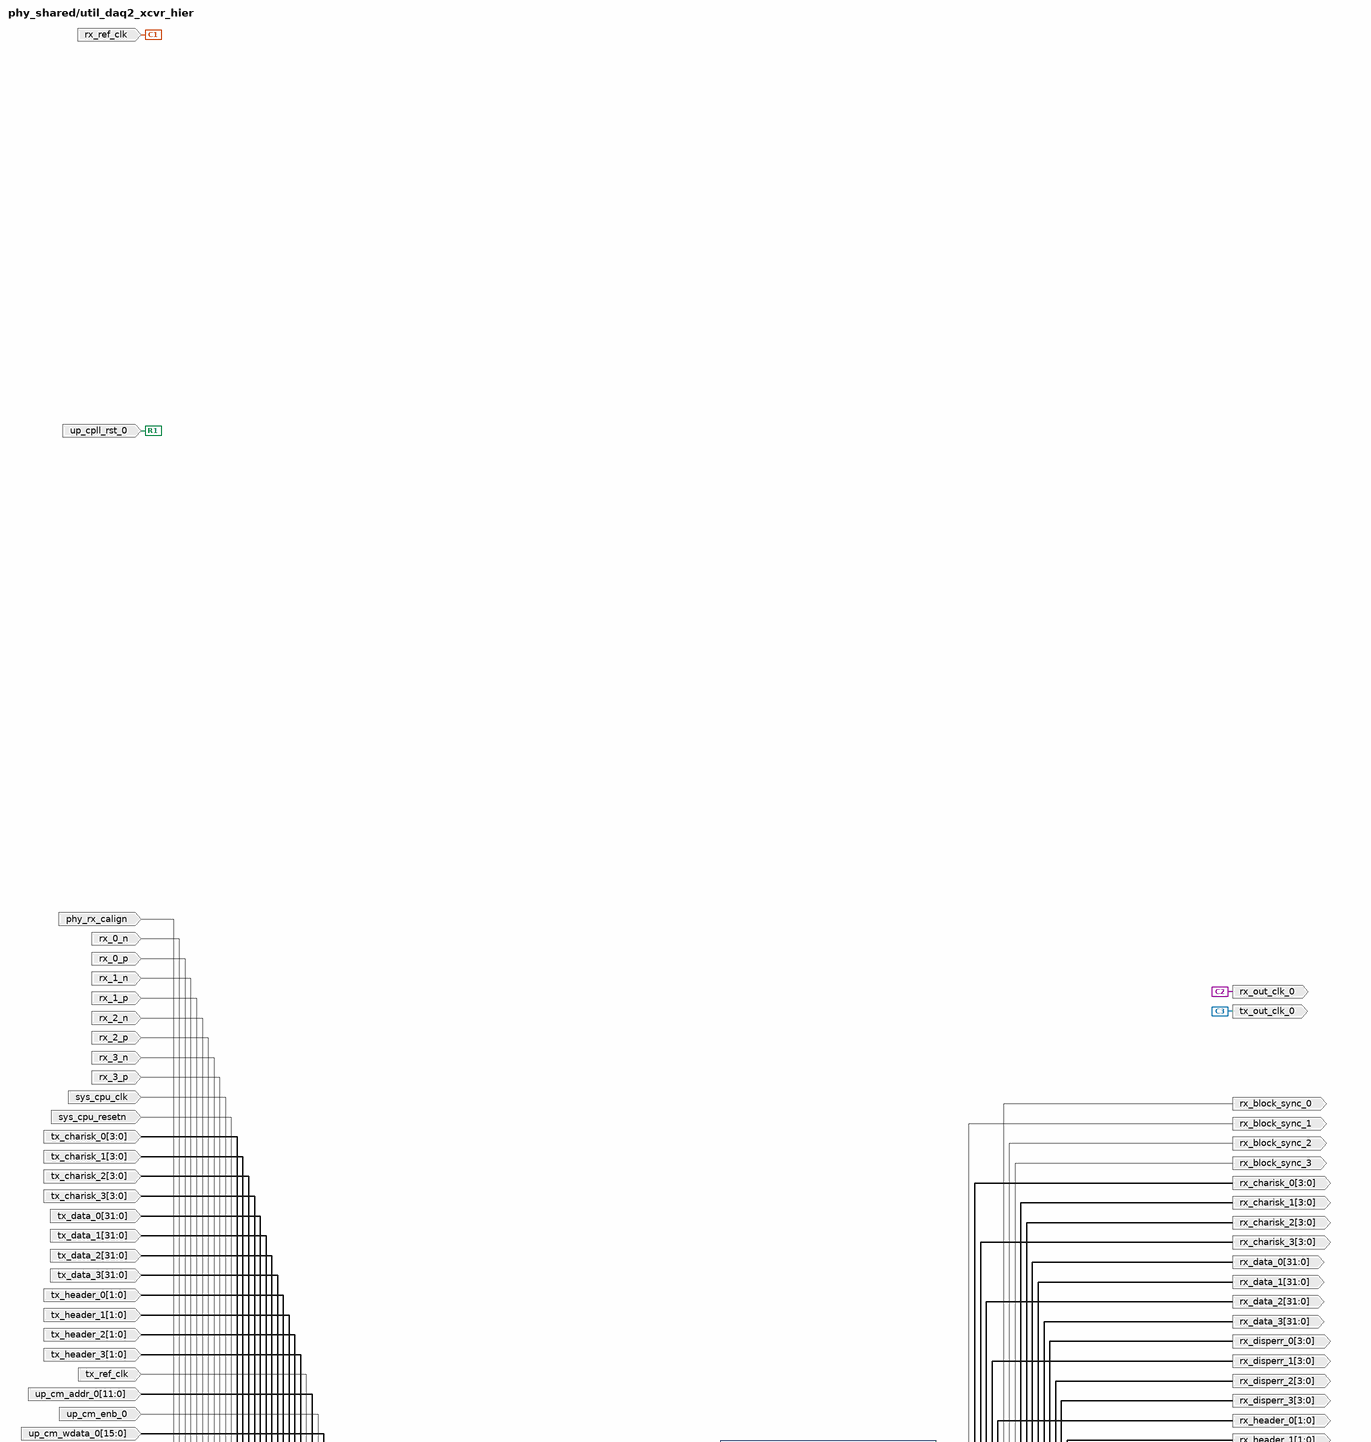
[diagram p8: block diagram inside /util_daq2_xcvr_hier, upper part]
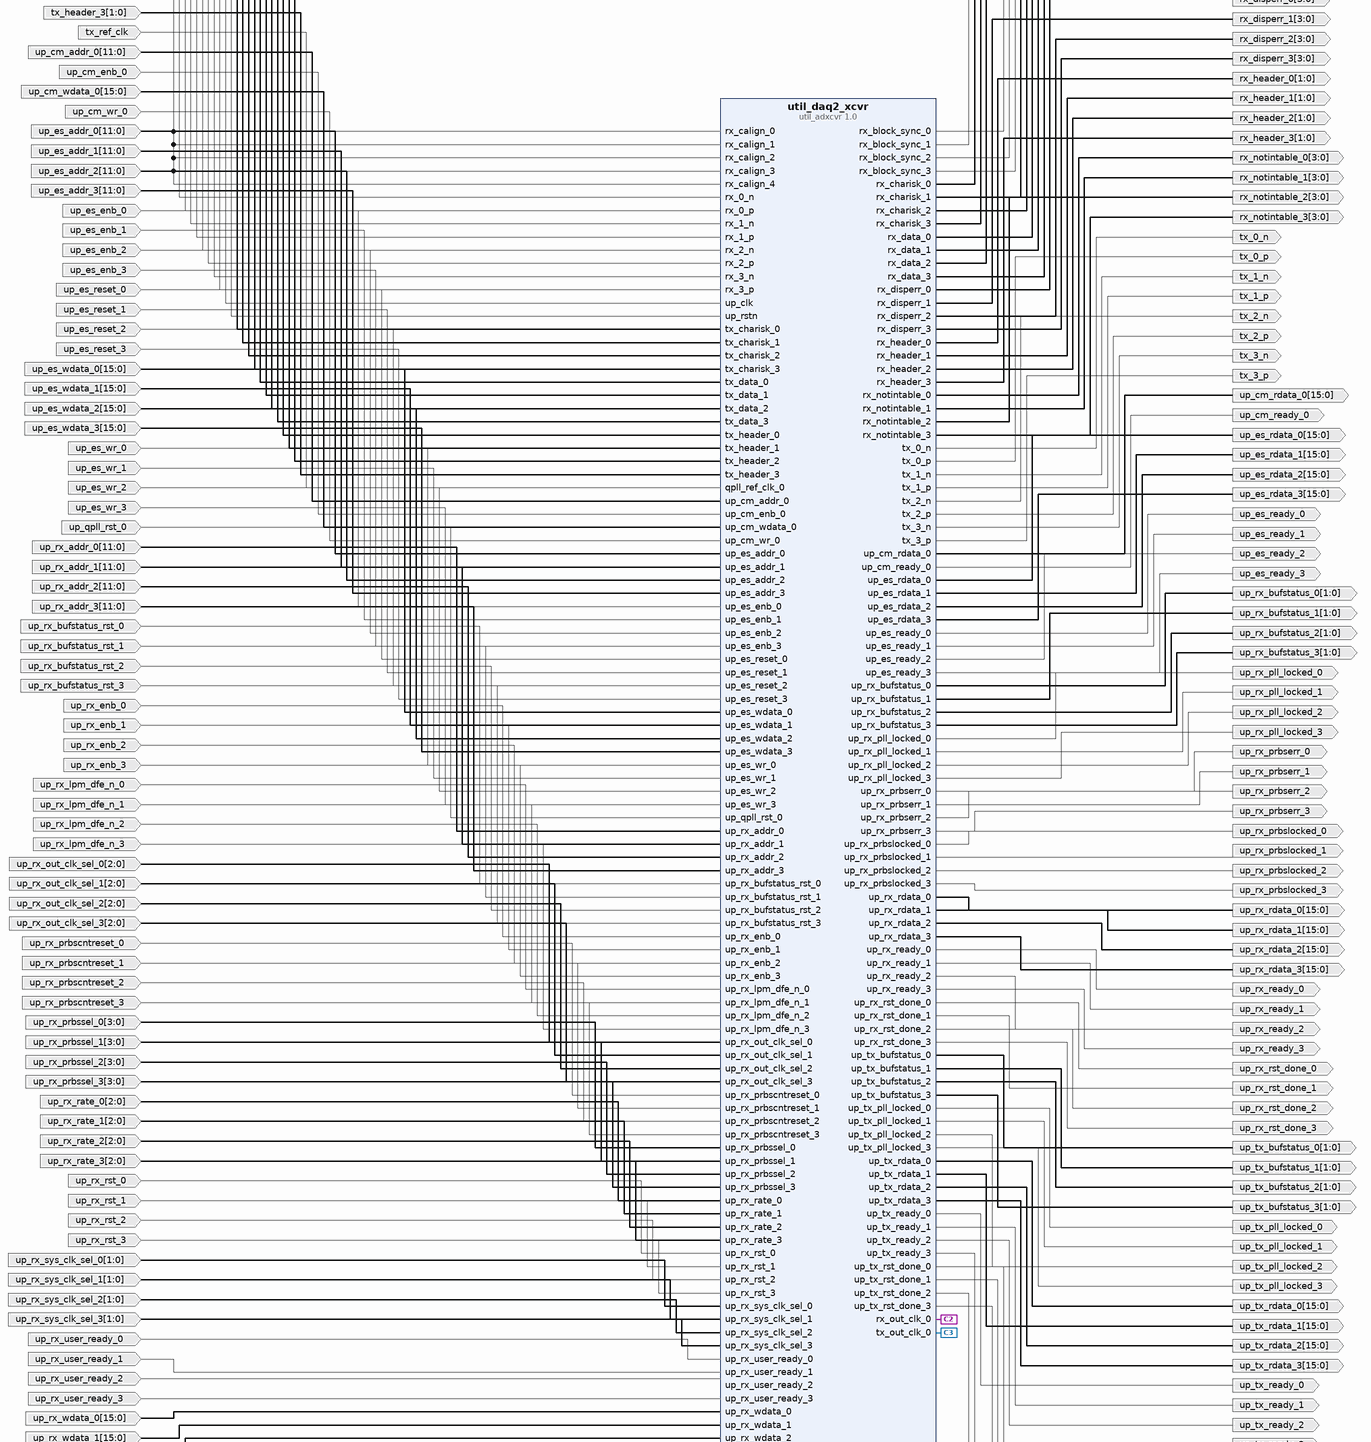
[diagram p9: block diagram inside /util_daq2_xcvr_hier, middle part]
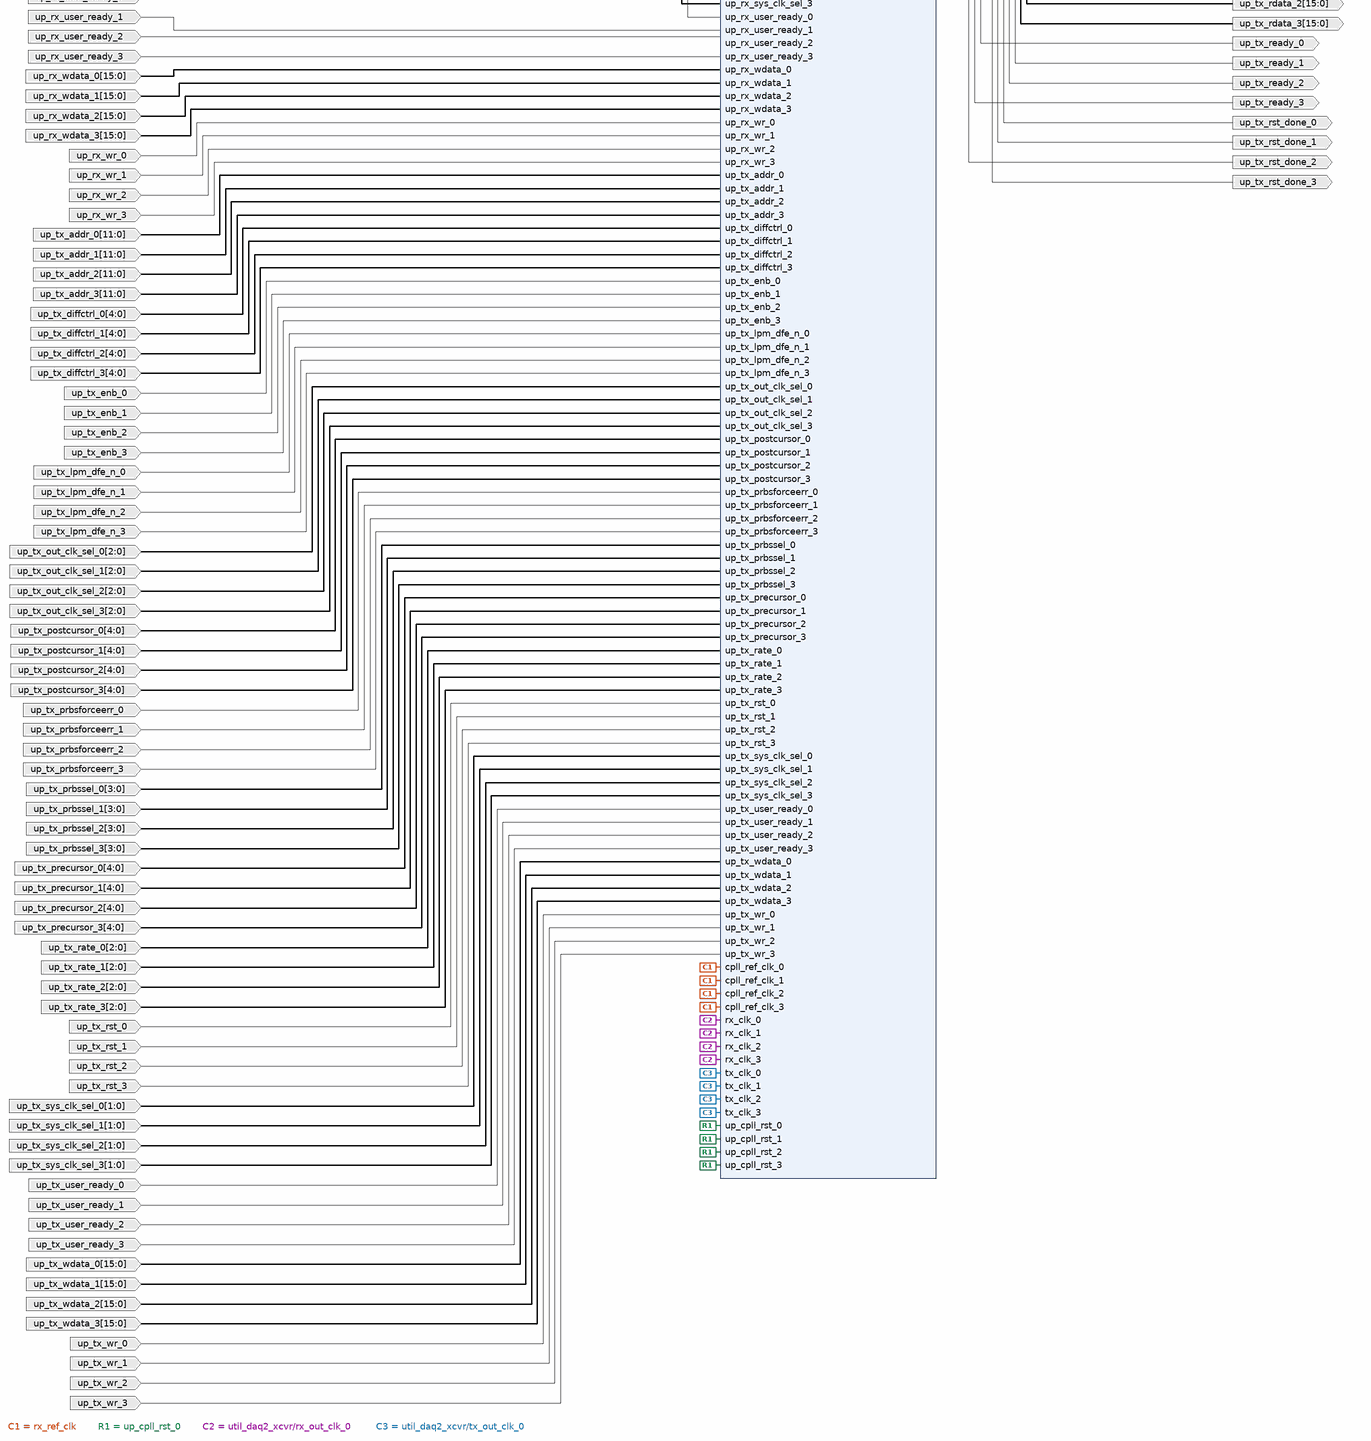
[diagram p10: block diagram inside /util_daq2_xcvr_hier, lower part]
create_bd_pin -dir O rx_out_clk_0
create_bd_pin -dir O tx_out_clk_0
create_bd_pin -dir I sys_cpu_resetn
create_bd_pin -dir I sys_cpu_clk
create_bd_pin -dir I tx_ref_clk
create_bd_pin -dir I up_qpll_rst_0
create_bd_pin -dir I rx_ref_clk
create_bd_pin -dir I up_cpll_rst_0
create_bd_pin -dir I rx_0_p
create_bd_pin -dir I rx_0_n
create_bd_pin -dir I phy_rx_calign
create_bd_pin -dir O up_rx_ready_3
create_bd_pin -dir O -from 15 -to 0 up_rx_rdata_3
create_bd_pin -dir O up_rx_ready_2
create_bd_pin -dir O up_rx_ready_1
create_bd_pin -dir O tx_0_p
create_bd_pin -dir O tx_0_n
create_bd_pin -dir O -from 3 -to 0 rx_charisk_0
create_bd_pin -dir O -from 3 -to 0 rx_disperr_0
create_bd_pin -dir O -from 3 -to 0 rx_notintable_0
create_bd_pin -dir O -from 31 -to 0 rx_data_0
create_bd_pin -dir O -from 1 -to 0 rx_header_0
create_bd_pin -dir O rx_block_sync_0
create_bd_pin -dir O -from 15 -to 0 up_cm_rdata_0
create_bd_pin -dir O up_cm_ready_0
create_bd_pin -dir O -from 15 -to 0 up_es_rdata_0
create_bd_pin -dir O up_rx_pll_locked_0
create_bd_pin -dir O up_rx_prbserr_0
create_bd_pin -dir O up_es_ready_0
create_bd_pin -dir O up_rx_rst_done_0
create_bd_pin -dir O up_rx_prbslocked_0
create_bd_pin -dir O -from 1 -to 0 up_rx_bufstatus_0
create_bd_pin -dir O -from 15 -to 0 up_rx_rdata_0
create_bd_pin -dir O up_rx_ready_0
create_bd_pin -dir O up_tx_pll_locked_0
create_bd_pin -dir O up_tx_rst_done_0
create_bd_pin -dir O -from 1 -to 0 up_tx_bufstatus_0
create_bd_pin -dir O -from 15 -to 0 up_tx_rdata_0
create_bd_pin -dir O up_tx_ready_0
create_bd_pin -dir O -from 3 -to 0 rx_charisk_1
create_bd_pin -dir O -from 3 -to 0 rx_disperr_1
create_bd_pin -dir O -from 3 -to 0 rx_notintable_1
create_bd_pin -dir O -from 31 -to 0 rx_data_1
create_bd_pin -dir O -from 1 -to 0 rx_header_1
create_bd_pin -dir O rx_block_sync_1
create_bd_pin -dir O tx_1_p
create_bd_pin -dir O tx_1_n
create_bd_pin -dir O -from 15 -to 0 up_es_rdata_1
create_bd_pin -dir O up_es_ready_1
create_bd_pin -dir O up_rx_pll_locked_1
create_bd_pin -dir O up_rx_rst_done_1
create_bd_pin -dir O up_rx_prbserr_1
create_bd_pin -dir O up_rx_prbslocked_1
create_bd_pin -dir O -from 1 -to 0 up_rx_bufstatus_1
create_bd_pin -dir O -from 15 -to 0 up_rx_rdata_1
create_bd_pin -dir O up_tx_pll_locked_1
create_bd_pin -dir O up_tx_rst_done_1
create_bd_pin -dir O -from 1 -to 0 up_tx_bufstatus_1
create_bd_pin -dir O -from 15 -to 0 up_tx_rdata_1
create_bd_pin -dir O up_tx_ready_1
create_bd_pin -dir O -from 3 -to 0 rx_charisk_2
create_bd_pin -dir O -from 3 -to 0 rx_disperr_2
create_bd_pin -dir O -from 3 -to 0 rx_notintable_2
create_bd_pin -dir O -from 31 -to 0 rx_data_2
create_bd_pin -dir O -from 1 -to 0 rx_header_2
create_bd_pin -dir O rx_block_sync_2
create_bd_pin -dir O tx_2_p
create_bd_pin -dir O tx_2_n
create_bd_pin -dir O -from 15 -to 0 up_es_rdata_2
create_bd_pin -dir O up_es_ready_2
create_bd_pin -dir O up_rx_pll_locked_2
create_bd_pin -dir O up_rx_rst_done_2
create_bd_pin -dir O up_rx_prbserr_2
create_bd_pin -dir O up_rx_prbslocked_2
create_bd_pin -dir O -from 15 -to 0 up_rx_rdata_2
create_bd_pin -dir O up_tx_pll_locked_2
create_bd_pin -dir O up_tx_rst_done_2
create_bd_pin -dir O -from 1 -to 0 up_tx_bufstatus_2
create_bd_pin -dir O -from 15 -to 0 up_tx_rdata_2
create_bd_pin -dir O up_tx_ready_2
create_bd_pin -dir O -from 3 -to 0 rx_charisk_3
create_bd_pin -dir O -from 3 -to 0 rx_disperr_3
create_bd_pin -dir O -from 3 -to 0 rx_notintable_3
create_bd_pin -dir O -from 31 -to 0 rx_data_3
create_bd_pin -dir O -from 1 -to 0 rx_header_3
create_bd_pin -dir O rx_block_sync_3
create_bd_pin -dir O tx_3_p
create_bd_pin -dir O tx_3_n
create_bd_pin -dir O -from 15 -to 0 up_es_rdata_3
create_bd_pin -dir O up_es_ready_3
create_bd_pin -dir O up_rx_pll_locked_3
create_bd_pin -dir O up_rx_rst_done_3
create_bd_pin -dir O up_rx_prbserr_3
create_bd_pin -dir O up_rx_prbslocked_3
create_bd_pin -dir O -from 1 -to 0 up_rx_bufstatus_3
create_bd_pin -dir O -from 1 -to 0 up_rx_bufstatus_2
create_bd_pin -dir O up_tx_pll_locked_3
create_bd_pin -dir O up_tx_rst_done_3
create_bd_pin -dir O -from 1 -to 0 up_tx_bufstatus_3
create_bd_pin -dir O -from 15 -to 0 up_tx_rdata_3
create_bd_pin -dir O up_tx_ready_3
create_bd_pin -dir I up_es_enb_0
create_bd_pin -dir I -from 11 -to 0 up_es_addr_0
create_bd_pin -dir I up_es_wr_0
create_bd_pin -dir I up_es_reset_0
create_bd_pin -dir I -from 15 -to 0 up_es_wdata_0
create_bd_pin -dir I up_rx_rst_0
create_bd_pin -dir I up_rx_user_ready_0
create_bd_pin -dir I -from 3 -to 0 up_rx_prbssel_0
create_bd_pin -dir I up_rx_prbscntreset_0
create_bd_pin -dir I up_rx_bufstatus_rst_0
create_bd_pin -dir I up_rx_lpm_dfe_n_0
create_bd_pin -dir I -from 2 -to 0 up_rx_rate_0
create_bd_pin -dir I -from 1 -to 0 up_rx_sys_clk_sel_0
create_bd_pin -dir I -from 2 -to 0 up_rx_out_clk_sel_0
create_bd_pin -dir I up_rx_enb_0
create_bd_pin -dir I -from 11 -to 0 up_rx_addr_0
create_bd_pin -dir I up_rx_wr_0
create_bd_pin -dir I -from 15 -to 0 up_rx_wdata_0
create_bd_pin -dir I up_es_enb_1
create_bd_pin -dir I -from 11 -to 0 up_es_addr_1
create_bd_pin -dir I up_es_wr_1
create_bd_pin -dir I up_es_reset_1
create_bd_pin -dir I -from 15 -to 0 up_es_wdata_1
create_bd_pin -dir I up_rx_rst_1
create_bd_pin -dir I up_rx_user_ready_1
create_bd_pin -dir I -from 3 -to 0 up_rx_prbssel_1
create_bd_pin -dir I up_rx_prbscntreset_1
create_bd_pin -dir I up_rx_bufstatus_rst_1
create_bd_pin -dir I up_rx_lpm_dfe_n_1
create_bd_pin -dir I -from 2 -to 0 up_rx_rate_1
create_bd_pin -dir I -from 1 -to 0 up_rx_sys_clk_sel_1
create_bd_pin -dir I -from 2 -to 0 up_rx_out_clk_sel_1
create_bd_pin -dir I up_rx_enb_1
create_bd_pin -dir I -from 11 -to 0 up_rx_addr_1
create_bd_pin -dir I up_rx_wr_1
create_bd_pin -dir I -from 15 -to 0 up_rx_wdata_1
create_bd_pin -dir I up_es_enb_2
create_bd_pin -dir I -from 11 -to 0 up_es_addr_2
create_bd_pin -dir I up_es_wr_2
create_bd_pin -dir I up_es_reset_2
create_bd_pin -dir I -from 15 -to 0 up_es_wdata_2
create_bd_pin -dir I up_rx_rst_2
create_bd_pin -dir I up_rx_user_ready_2
create_bd_pin -dir I -from 3 -to 0 up_rx_prbssel_2
create_bd_pin -dir I up_rx_prbscntreset_2
create_bd_pin -dir I up_rx_bufstatus_rst_2
create_bd_pin -dir I up_rx_lpm_dfe_n_2
create_bd_pin -dir I -from 2 -to 0 up_rx_rate_2
create_bd_pin -dir I -from 1 -to 0 up_rx_sys_clk_sel_2
create_bd_pin -dir I -from 2 -to 0 up_rx_out_clk_sel_2
create_bd_pin -dir I up_rx_enb_2
create_bd_pin -dir I -from 11 -to 0 up_rx_addr_2
create_bd_pin -dir I up_rx_wr_2
create_bd_pin -dir I -from 15 -to 0 up_rx_wdata_2
create_bd_pin -dir I up_es_enb_3
create_bd_pin -dir I -from 11 -to 0 up_es_addr_3
create_bd_pin -dir I up_es_wr_3
create_bd_pin -dir I up_es_reset_3
create_bd_pin -dir I -from 15 -to 0 up_es_wdata_3
create_bd_pin -dir I up_rx_rst_3
create_bd_pin -dir I up_rx_user_ready_3
create_bd_pin -dir I -from 3 -to 0 up_rx_prbssel_3
create_bd_pin -dir I up_rx_prbscntreset_3
create_bd_pin -dir I up_rx_bufstatus_rst_3
create_bd_pin -dir I up_rx_lpm_dfe_n_3
create_bd_pin -dir I -from 2 -to 0 up_rx_rate_3
create_bd_pin -dir I -from 1 -to 0 up_rx_sys_clk_sel_3
create_bd_pin -dir I -from 2 -to 0 up_rx_out_clk_sel_3
create_bd_pin -dir I up_rx_enb_3
create_bd_pin -dir I -from 11 -to 0 up_rx_addr_3
create_bd_pin -dir I up_rx_wr_3
create_bd_pin -dir I -from 15 -to 0 up_rx_wdata_3
create_bd_pin -dir I rx_3_p
create_bd_pin -dir I rx_3_n
create_bd_pin -dir I rx_2_p
create_bd_pin -dir I rx_2_n
create_bd_pin -dir I rx_1_p
create_bd_pin -dir I rx_1_n
create_bd_pin -dir I up_cm_enb_0
create_bd_pin -dir I -from 11 -to 0 up_cm_addr_0
create_bd_pin -dir I up_cm_wr_0
create_bd_pin -dir I -from 15 -to 0 up_cm_wdata_0
create_bd_pin -dir I up_tx_rst_0
create_bd_pin -dir I up_tx_user_ready_0
create_bd_pin -dir I up_tx_prbsforceerr_0
create_bd_pin -dir I -from 3 -to 0 up_tx_prbssel_0
create_bd_pin -dir I up_tx_lpm_dfe_n_0
create_bd_pin -dir I -from 2 -to 0 up_tx_rate_0
create_bd_pin -dir I -from 1 -to 0 up_tx_sys_clk_sel_0
create_bd_pin -dir I -from 2 -to 0 up_tx_out_clk_sel_0
create_bd_pin -dir I -from 4 -to 0 up_tx_diffctrl_0
create_bd_pin -dir I -from 4 -to 0 up_tx_postcursor_0
create_bd_pin -dir I -from 4 -to 0 up_tx_precursor_0
create_bd_pin -dir I up_tx_enb_0
create_bd_pin -dir I -from 11 -to 0 up_tx_addr_0
create_bd_pin -dir I up_tx_wr_0
create_bd_pin -dir I -from 15 -to 0 up_tx_wdata_0
create_bd_pin -dir I up_tx_rst_2
create_bd_pin -dir I up_tx_user_ready_2
create_bd_pin -dir I up_tx_prbsforceerr_2
create_bd_pin -dir I -from 3 -to 0 up_tx_prbssel_2
create_bd_pin -dir I up_tx_lpm_dfe_n_2
create_bd_pin -dir I -from 2 -to 0 up_tx_rate_2
create_bd_pin -dir I -from 1 -to 0 up_tx_sys_clk_sel_2
create_bd_pin -dir I -from 2 -to 0 up_tx_out_clk_sel_2
create_bd_pin -dir I -from 4 -to 0 up_tx_diffctrl_2
create_bd_pin -dir I -from 4 -to 0 up_tx_postcursor_2
create_bd_pin -dir I -from 4 -to 0 up_tx_precursor_2
create_bd_pin -dir I up_tx_enb_2
create_bd_pin -dir I -from 11 -to 0 up_tx_addr_2
create_bd_pin -dir I up_tx_wr_2
create_bd_pin -dir I -from 15 -to 0 up_tx_wdata_2
create_bd_pin -dir I up_tx_rst_3
create_bd_pin -dir I up_tx_user_ready_3
create_bd_pin -dir I up_tx_prbsforceerr_3
create_bd_pin -dir I -from 3 -to 0 up_tx_prbssel_3
create_bd_pin -dir I up_tx_lpm_dfe_n_3
create_bd_pin -dir I -from 2 -to 0 up_tx_rate_3
create_bd_pin -dir I -from 1 -to 0 up_tx_sys_clk_sel_3
create_bd_pin -dir I -from 2 -to 0 up_tx_out_clk_sel_3
create_bd_pin -dir I -from 4 -to 0 up_tx_diffctrl_3
create_bd_pin -dir I -from 4 -to 0 up_tx_postcursor_3
create_bd_pin -dir I -from 4 -to 0 up_tx_precursor_3
create_bd_pin -dir I up_tx_enb_3
create_bd_pin -dir I -from 11 -to 0 up_tx_addr_3
create_bd_pin -dir I up_tx_wr_3
create_bd_pin -dir I -from 15 -to 0 up_tx_wdata_3
create_bd_pin -dir I up_tx_rst_1
create_bd_pin -dir I up_tx_user_ready_1
create_bd_pin -dir I up_tx_prbsforceerr_1
create_bd_pin -dir I -from 3 -to 0 up_tx_prbssel_1
create_bd_pin -dir I up_tx_lpm_dfe_n_1
create_bd_pin -dir I -from 2 -to 0 up_tx_rate_1
create_bd_pin -dir I -from 1 -to 0 up_tx_sys_clk_sel_1
create_bd_pin -dir I -from 2 -to 0 up_tx_out_clk_sel_1
create_bd_pin -dir I -from 4 -to 0 up_tx_diffctrl_1
create_bd_pin -dir I -from 4 -to 0 up_tx_postcursor_1
create_bd_pin -dir I -from 4 -to 0 up_tx_precursor_1
create_bd_pin -dir I up_tx_enb_1
create_bd_pin -dir I -from 11 -to 0 up_tx_addr_1
create_bd_pin -dir I up_tx_wr_1
create_bd_pin -dir I -from 15 -to 0 up_tx_wdata_1
create_bd_pin -dir I -from 3 -to 0 tx_charisk_0
create_bd_pin -dir I -from 31 -to 0 tx_data_0
create_bd_pin -dir I -from 1 -to 0 tx_header_0
create_bd_pin -dir I -from 3 -to 0 tx_charisk_1
create_bd_pin -dir I -from 31 -to 0 tx_data_1
create_bd_pin -dir I -from 1 -to 0 tx_header_1
create_bd_pin -dir I -from 3 -to 0 tx_charisk_2
create_bd_pin -dir I -from 31 -to 0 tx_data_2
create_bd_pin -dir I -from 1 -to 0 tx_header_2
create_bd_pin -dir I -from 3 -to 0 tx_charisk_3
create_bd_pin -dir I -from 31 -to 0 tx_data_3
create_bd_pin -dir I -from 1 -to 0 tx_header_3

create_bd_cell -type ip -vlnv analog.devices:user:util_adxcvr:1.0 util_daq2_xcvr
set_property -dict [list \
  CONFIG.RX_LANE_RATE 10 \
  CONFIG.RX_NUM_OF_LANES 4 \
  CONFIG.TX_LANE_RATE 10 \
  CONFIG.TX_NUM_OF_LANES 4 \
] [get_bd_cells util_daq2_xcvr]

# ---- connections ----

current_bd_instance /axi_ad9144_adxcvr_hier
connect_bd_intf_net [get_bd_intf_pins s_axi] [get_bd_intf_pins axi_ad9144_adxcvr/s_axi]
connect_bd_net [get_bd_pins axi_ad9144_adxcvr/up_ch_addr_0] [get_bd_pins up_ch_addr_0]
connect_bd_net [get_bd_pins axi_ad9144_adxcvr/up_ch_addr_1] [get_bd_pins up_ch_addr_1]
connect_bd_net [get_bd_pins axi_ad9144_adxcvr/up_ch_addr_2] [get_bd_pins up_ch_addr_2]
connect_bd_net [get_bd_pins axi_ad9144_adxcvr/up_ch_addr_3] [get_bd_pins up_ch_addr_3]
connect_bd_net [get_bd_pins axi_ad9144_adxcvr/up_ch_enb_0] [get_bd_pins up_ch_enb_0]
connect_bd_net [get_bd_pins axi_ad9144_adxcvr/up_ch_enb_1] [get_bd_pins up_ch_enb_1]
connect_bd_net [get_bd_pins axi_ad9144_adxcvr/up_ch_enb_2] [get_bd_pins up_ch_enb_2]
connect_bd_net [get_bd_pins axi_ad9144_adxcvr/up_ch_enb_3] [get_bd_pins up_ch_enb_3]
connect_bd_net [get_bd_pins axi_ad9144_adxcvr/up_ch_lpm_dfe_n_0] [get_bd_pins up_ch_lpm_dfe_n_0]
connect_bd_net [get_bd_pins axi_ad9144_adxcvr/up_ch_lpm_dfe_n_1] [get_bd_pins up_ch_lpm_dfe_n_1]
connect_bd_net [get_bd_pins axi_ad9144_adxcvr/up_ch_lpm_dfe_n_2] [get_bd_pins up_ch_lpm_dfe_n_2]
connect_bd_net [get_bd_pins axi_ad9144_adxcvr/up_ch_lpm_dfe_n_3] [get_bd_pins up_ch_lpm_dfe_n_3]
connect_bd_net [get_bd_pins axi_ad9144_adxcvr/up_ch_out_clk_sel_0] [get_bd_pins up_ch_out_clk_sel_0]
connect_bd_net [get_bd_pins axi_ad9144_adxcvr/up_ch_out_clk_sel_1] [get_bd_pins up_ch_out_clk_sel_1]
connect_bd_net [get_bd_pins axi_ad9144_adxcvr/up_ch_out_clk_sel_2] [get_bd_pins up_ch_out_clk_sel_2]
connect_bd_net [get_bd_pins axi_ad9144_adxcvr/up_ch_out_clk_sel_3] [get_bd_pins up_ch_out_clk_sel_3]
connect_bd_net [get_bd_pins axi_ad9144_adxcvr/up_ch_prbsforceerr_0] [get_bd_pins up_ch_prbsforceerr_0]
connect_bd_net [get_bd_pins axi_ad9144_adxcvr/up_ch_prbsforceerr_1] [get_bd_pins up_ch_prbsforceerr_1]
connect_bd_net [get_bd_pins axi_ad9144_adxcvr/up_ch_prbsforceerr_2] [get_bd_pins up_ch_prbsforceerr_2]
connect_bd_net [get_bd_pins axi_ad9144_adxcvr/up_ch_prbsforceerr_3] [get_bd_pins up_ch_prbsforceerr_3]
connect_bd_net [get_bd_pins axi_ad9144_adxcvr/up_ch_prbssel_0] [get_bd_pins up_ch_prbssel_0]
connect_bd_net [get_bd_pins axi_ad9144_adxcvr/up_ch_prbssel_1] [get_bd_pins up_ch_prbssel_1]
connect_bd_net [get_bd_pins axi_ad9144_adxcvr/up_ch_prbssel_2] [get_bd_pins up_ch_prbssel_2]
connect_bd_net [get_bd_pins axi_ad9144_adxcvr/up_ch_prbssel_3] [get_bd_pins up_ch_prbssel_3]
connect_bd_net [get_bd_pins axi_ad9144_adxcvr/up_ch_rate_0] [get_bd_pins up_ch_rate_0]
connect_bd_net [get_bd_pins axi_ad9144_adxcvr/up_ch_rate_1] [get_bd_pins up_ch_rate_1]
connect_bd_net [get_bd_pins axi_ad9144_adxcvr/up_ch_rate_2] [get_bd_pins up_ch_rate_2]
connect_bd_net [get_bd_pins axi_ad9144_adxcvr/up_ch_rate_3] [get_bd_pins up_ch_rate_3]
connect_bd_net [get_bd_pins axi_ad9144_adxcvr/up_ch_rst_0] [get_bd_pins up_ch_rst_0]
connect_bd_net [get_bd_pins axi_ad9144_adxcvr/up_ch_rst_1] [get_bd_pins up_ch_rst_1]
connect_bd_net [get_bd_pins axi_ad9144_adxcvr/up_ch_rst_2] [get_bd_pins up_ch_rst_2]
connect_bd_net [get_bd_pins axi_ad9144_adxcvr/up_ch_rst_3] [get_bd_pins up_ch_rst_3]
connect_bd_net [get_bd_pins axi_ad9144_adxcvr/up_ch_sys_clk_sel_0] [get_bd_pins up_ch_sys_clk_sel_0]
connect_bd_net [get_bd_pins axi_ad9144_adxcvr/up_ch_sys_clk_sel_1] [get_bd_pins up_ch_sys_clk_sel_1]
connect_bd_net [get_bd_pins axi_ad9144_adxcvr/up_ch_sys_clk_sel_2] [get_bd_pins up_ch_sys_clk_sel_2]
connect_bd_net [get_bd_pins axi_ad9144_adxcvr/up_ch_sys_clk_sel_3] [get_bd_pins up_ch_sys_clk_sel_3]
connect_bd_net [get_bd_pins axi_ad9144_adxcvr/up_ch_tx_diffctrl_0] [get_bd_pins up_ch_tx_diffctrl_0]
connect_bd_net [get_bd_pins axi_ad9144_adxcvr/up_ch_tx_diffctrl_1] [get_bd_pins up_ch_tx_diffctrl_1]
connect_bd_net [get_bd_pins axi_ad9144_adxcvr/up_ch_tx_diffctrl_2] [get_bd_pins up_ch_tx_diffctrl_2]
connect_bd_net [get_bd_pins axi_ad9144_adxcvr/up_ch_tx_diffctrl_3] [get_bd_pins up_ch_tx_diffctrl_3]
connect_bd_net [get_bd_pins axi_ad9144_adxcvr/up_ch_tx_postcursor_0] [get_bd_pins up_ch_tx_postcursor_0]
connect_bd_net [get_bd_pins axi_ad9144_adxcvr/up_ch_tx_postcursor_1] [get_bd_pins up_ch_tx_postcursor_1]
connect_bd_net [get_bd_pins axi_ad9144_adxcvr/up_ch_tx_postcursor_2] [get_bd_pins up_ch_tx_postcursor_2]
connect_bd_net [get_bd_pins axi_ad9144_adxcvr/up_ch_tx_postcursor_3] [get_bd_pins up_ch_tx_postcursor_3]
connect_bd_net [get_bd_pins axi_ad9144_adxcvr/up_ch_tx_precursor_0] [get_bd_pins up_ch_tx_precursor_0]
connect_bd_net [get_bd_pins axi_ad9144_adxcvr/up_ch_tx_precursor_1] [get_bd_pins up_ch_tx_precursor_1]
connect_bd_net [get_bd_pins axi_ad9144_adxcvr/up_ch_tx_precursor_2] [get_bd_pins up_ch_tx_precursor_2]
connect_bd_net [get_bd_pins axi_ad9144_adxcvr/up_ch_tx_precursor_3] [get_bd_pins up_ch_tx_precursor_3]
connect_bd_net [get_bd_pins axi_ad9144_adxcvr/up_ch_user_ready_0] [get_bd_pins up_ch_user_ready_0]
connect_bd_net [get_bd_pins axi_ad9144_adxcvr/up_ch_user_ready_1] [get_bd_pins up_ch_user_ready_1]
connect_bd_net [get_bd_pins axi_ad9144_adxcvr/up_ch_user_ready_2] [get_bd_pins up_ch_user_ready_2]
connect_bd_net [get_bd_pins axi_ad9144_adxcvr/up_ch_user_ready_3] [get_bd_pins up_ch_user_ready_3]
connect_bd_net [get_bd_pins axi_ad9144_adxcvr/up_ch_wdata_0] [get_bd_pins up_ch_wdata_0]
connect_bd_net [get_bd_pins axi_ad9144_adxcvr/up_ch_wdata_1] [get_bd_pins up_ch_wdata_1]
connect_bd_net [get_bd_pins axi_ad9144_adxcvr/up_ch_wdata_2] [get_bd_pins up_ch_wdata_2]
connect_bd_net [get_bd_pins axi_ad9144_adxcvr/up_ch_wdata_3] [get_bd_pins up_ch_wdata_3]
connect_bd_net [get_bd_pins axi_ad9144_adxcvr/up_ch_wr_0] [get_bd_pins up_ch_wr_0]
connect_bd_net [get_bd_pins axi_ad9144_adxcvr/up_ch_wr_1] [get_bd_pins up_ch_wr_1]
connect_bd_net [get_bd_pins axi_ad9144_adxcvr/up_ch_wr_2] [get_bd_pins up_ch_wr_2]
connect_bd_net [get_bd_pins axi_ad9144_adxcvr/up_ch_wr_3] [get_bd_pins up_ch_wr_3]
connect_bd_net [get_bd_pins axi_ad9144_adxcvr/up_cm_addr_0] [get_bd_pins up_cm_addr_0]
connect_bd_net [get_bd_pins axi_ad9144_adxcvr/up_cm_enb_0] [get_bd_pins up_cm_enb_0]
connect_bd_net [get_bd_pins axi_ad9144_adxcvr/up_cm_wdata_0] [get_bd_pins up_cm_wdata_0]
connect_bd_net [get_bd_pins axi_ad9144_adxcvr/up_cm_wr_0] [get_bd_pins up_cm_wr_0]
connect_bd_net [get_bd_pins axi_ad9144_adxcvr/up_pll_rst] [get_bd_pins up_pll_rst]
connect_bd_net [get_bd_pins s_axi_aclk] [get_bd_pins axi_ad9144_adxcvr/s_axi_aclk]
connect_bd_net [get_bd_pins s_axi_aresetn] [get_bd_pins axi_ad9144_adxcvr/s_axi_aresetn]
connect_bd_net -net up_ch_bufstatus_0_1 [get_bd_pins up_ch_bufstatus_0] [get_bd_pins axi_ad9144_adxcvr/up_ch_bufstatus_0]
connect_bd_net -net up_ch_bufstatus_1_1 [get_bd_pins up_ch_bufstatus_1] [get_bd_pins axi_ad9144_adxcvr/up_ch_bufstatus_1]
connect_bd_net -net up_ch_bufstatus_2_1 [get_bd_pins up_ch_bufstatus_2] [get_bd_pins axi_ad9144_adxcvr/up_ch_bufstatus_2]
connect_bd_net -net up_ch_bufstatus_3_1 [get_bd_pins up_ch_bufstatus_3] [get_bd_pins axi_ad9144_adxcvr/up_ch_bufstatus_3]
connect_bd_net -net up_ch_pll_locked_0_1 [get_bd_pins up_ch_pll_locked_0] [get_bd_pins axi_ad9144_adxcvr/up_ch_pll_locked_0]
connect_bd_net -net up_ch_pll_locked_1_1 [get_bd_pins up_ch_pll_locked_1] [get_bd_pins axi_ad9144_adxcvr/up_ch_pll_locked_1]
connect_bd_net -net up_ch_pll_locked_2_1 [get_bd_pins up_ch_pll_locked_2] [get_bd_pins axi_ad9144_adxcvr/up_ch_pll_locked_2]
connect_bd_net -net up_ch_pll_locked_3_1 [get_bd_pins up_ch_pll_locked_3] [get_bd_pins axi_ad9144_adxcvr/up_ch_pll_locked_3]
connect_bd_net -net up_ch_rdata_0_1 [get_bd_pins up_ch_rdata_0] [get_bd_pins axi_ad9144_adxcvr/up_ch_rdata_0]
connect_bd_net -net up_ch_rdata_1_1 [get_bd_pins up_ch_rdata_1] [get_bd_pins axi_ad9144_adxcvr/up_ch_rdata_1]
connect_bd_net -net up_ch_rdata_2_1 [get_bd_pins up_ch_rdata_2] [get_bd_pins axi_ad9144_adxcvr/up_ch_rdata_2]
connect_bd_net -net up_ch_rdata_3_1 [get_bd_pins up_ch_rdata_3] [get_bd_pins axi_ad9144_adxcvr/up_ch_rdata_3]
connect_bd_net -net up_ch_ready_0_1 [get_bd_pins up_ch_ready_0] [get_bd_pins axi_ad9144_adxcvr/up_ch_ready_0]
connect_bd_net -net up_ch_ready_1_1 [get_bd_pins up_ch_ready_1] [get_bd_pins axi_ad9144_adxcvr/up_ch_ready_1]
connect_bd_net -net up_ch_ready_2_1 [get_bd_pins up_ch_ready_2] [get_bd_pins axi_ad9144_adxcvr/up_ch_ready_2]
connect_bd_net -net up_ch_ready_3_1 [get_bd_pins up_ch_ready_3] [get_bd_pins axi_ad9144_adxcvr/up_ch_ready_3]
connect_bd_net -net up_ch_rst_done_0_1 [get_bd_pins up_ch_rst_done_0] [get_bd_pins axi_ad9144_adxcvr/up_ch_rst_done_0]
connect_bd_net -net up_ch_rst_done_1_1 [get_bd_pins up_ch_rst_done_1] [get_bd_pins axi_ad9144_adxcvr/up_ch_rst_done_1]
connect_bd_net -net up_ch_rst_done_2_1 [get_bd_pins up_ch_rst_done_2] [get_bd_pins axi_ad9144_adxcvr/up_ch_rst_done_2]
connect_bd_net -net up_ch_rst_done_3_1 [get_bd_pins up_ch_rst_done_3] [get_bd_pins axi_ad9144_adxcvr/up_ch_rst_done_3]
connect_bd_net -net up_cm_rdata_0_1 [get_bd_pins up_cm_rdata_0] [get_bd_pins axi_ad9144_adxcvr/up_cm_rdata_0]
connect_bd_net -net up_cm_ready_0_1 [get_bd_pins up_cm_ready_0] [get_bd_pins axi_ad9144_adxcvr/up_cm_ready_0]

current_bd_instance /axi_ad9680_adxcvr_hier
connect_bd_intf_net [get_bd_intf_pins s_axi] [get_bd_intf_pins axi_ad9680_adxcvr/s_axi]
connect_bd_net [get_bd_pins axi_ad9680_adxcvr/up_ch_addr_0] [get_bd_pins up_ch_addr_0]
connect_bd_net [get_bd_pins axi_ad9680_adxcvr/up_ch_addr_1] [get_bd_pins up_ch_addr_1]
connect_bd_net [get_bd_pins axi_ad9680_adxcvr/up_ch_addr_2] [get_bd_pins up_ch_addr_2]
connect_bd_net [get_bd_pins axi_ad9680_adxcvr/up_ch_addr_3] [get_bd_pins up_ch_addr_3]
connect_bd_net [get_bd_pins axi_ad9680_adxcvr/up_ch_bufstatus_rst_0] [get_bd_pins up_ch_bufstatus_rst_0]
connect_bd_net [get_bd_pins axi_ad9680_adxcvr/up_ch_bufstatus_rst_1] [get_bd_pins up_ch_bufstatus_rst_1]
connect_bd_net [get_bd_pins axi_ad9680_adxcvr/up_ch_bufstatus_rst_2] [get_bd_pins up_ch_bufstatus_rst_2]
connect_bd_net [get_bd_pins axi_ad9680_adxcvr/up_ch_bufstatus_rst_3] [get_bd_pins up_ch_bufstatus_rst_3]
connect_bd_net [get_bd_pins axi_ad9680_adxcvr/up_ch_enb_0] [get_bd_pins up_ch_enb_0]
connect_bd_net [get_bd_pins axi_ad9680_adxcvr/up_ch_enb_1] [get_bd_pins up_ch_enb_1]
connect_bd_net [get_bd_pins axi_ad9680_adxcvr/up_ch_enb_2] [get_bd_pins up_ch_enb_2]
connect_bd_net [get_bd_pins axi_ad9680_adxcvr/up_ch_enb_3] [get_bd_pins up_ch_enb_3]
connect_bd_net [get_bd_pins axi_ad9680_adxcvr/up_ch_lpm_dfe_n_0] [get_bd_pins up_ch_lpm_dfe_n_0]
connect_bd_net [get_bd_pins axi_ad9680_adxcvr/up_ch_lpm_dfe_n_1] [get_bd_pins up_ch_lpm_dfe_n_1]
connect_bd_net [get_bd_pins axi_ad9680_adxcvr/up_ch_lpm_dfe_n_2] [get_bd_pins up_ch_lpm_dfe_n_2]
connect_bd_net [get_bd_pins axi_ad9680_adxcvr/up_ch_lpm_dfe_n_3] [get_bd_pins up_ch_lpm_dfe_n_3]
connect_bd_net [get_bd_pins axi_ad9680_adxcvr/up_ch_out_clk_sel_0] [get_bd_pins up_ch_out_clk_sel_0]
connect_bd_net [get_bd_pins axi_ad9680_adxcvr/up_ch_out_clk_sel_1] [get_bd_pins up_ch_out_clk_sel_1]
connect_bd_net [get_bd_pins axi_ad9680_adxcvr/up_ch_out_clk_sel_2] [get_bd_pins up_ch_out_clk_sel_2]
connect_bd_net [get_bd_pins axi_ad9680_adxcvr/up_ch_out_clk_sel_3] [get_bd_pins up_ch_out_clk_sel_3]
connect_bd_net [get_bd_pins axi_ad9680_adxcvr/up_ch_prbscntreset_0] [get_bd_pins up_ch_prbscntreset_0]
connect_bd_net [get_bd_pins axi_ad9680_adxcvr/up_ch_prbscntreset_1] [get_bd_pins up_ch_prbscntreset_1]
connect_bd_net [get_bd_pins axi_ad9680_adxcvr/up_ch_prbscntreset_2] [get_bd_pins up_ch_prbscntreset_2]
connect_bd_net [get_bd_pins axi_ad9680_adxcvr/up_ch_prbscntreset_3] [get_bd_pins up_ch_prbscntreset_3]
connect_bd_net [get_bd_pins axi_ad9680_adxcvr/up_ch_prbssel_0] [get_bd_pins up_ch_prbssel_0]
connect_bd_net [get_bd_pins axi_ad9680_adxcvr/up_ch_prbssel_1] [get_bd_pins up_ch_prbssel_1]
connect_bd_net [get_bd_pins axi_ad9680_adxcvr/up_ch_prbssel_2] [get_bd_pins up_ch_prbssel_2]
connect_bd_net [get_bd_pins axi_ad9680_adxcvr/up_ch_prbssel_3] [get_bd_pins up_ch_prbssel_3]
connect_bd_net [get_bd_pins axi_ad9680_adxcvr/up_ch_rate_0] [get_bd_pins up_ch_rate_0]
connect_bd_net [get_bd_pins axi_ad9680_adxcvr/up_ch_rate_1] [get_bd_pins up_ch_rate_1]
connect_bd_net [get_bd_pins axi_ad9680_adxcvr/up_ch_rate_2] [get_bd_pins up_ch_rate_2]
connect_bd_net [get_bd_pins axi_ad9680_adxcvr/up_ch_rate_3] [get_bd_pins up_ch_rate_3]
connect_bd_net [get_bd_pins axi_ad9680_adxcvr/up_ch_rst_0] [get_bd_pins up_ch_rst_0]
connect_bd_net [get_bd_pins axi_ad9680_adxcvr/up_ch_rst_1] [get_bd_pins up_ch_rst_1]
connect_bd_net [get_bd_pins axi_ad9680_adxcvr/up_ch_rst_2] [get_bd_pins up_ch_rst_2]
connect_bd_net [get_bd_pins axi_ad9680_adxcvr/up_ch_rst_3] [get_bd_pins up_ch_rst_3]
connect_bd_net [get_bd_pins axi_ad9680_adxcvr/up_ch_sys_clk_sel_0] [get_bd_pins up_ch_sys_clk_sel_0]
connect_bd_net [get_bd_pins axi_ad9680_adxcvr/up_ch_sys_clk_sel_1] [get_bd_pins up_ch_sys_clk_sel_1]
connect_bd_net [get_bd_pins axi_ad9680_adxcvr/up_ch_sys_clk_sel_2] [get_bd_pins up_ch_sys_clk_sel_2]
connect_bd_net [get_bd_pins axi_ad9680_adxcvr/up_ch_sys_clk_sel_3] [get_bd_pins up_ch_sys_clk_sel_3]
connect_bd_net [get_bd_pins axi_ad9680_adxcvr/up_ch_user_ready_0] [get_bd_pins up_ch_user_ready_0]
connect_bd_net [get_bd_pins axi_ad9680_adxcvr/up_ch_user_ready_1] [get_bd_pins up_ch_user_ready_1]
connect_bd_net [get_bd_pins axi_ad9680_adxcvr/up_ch_user_ready_2] [get_bd_pins up_ch_user_ready_2]
connect_bd_net [get_bd_pins axi_ad9680_adxcvr/up_ch_user_ready_3] [get_bd_pins up_ch_user_ready_3]
connect_bd_net [get_bd_pins axi_ad9680_adxcvr/up_ch_wdata_0] [get_bd_pins up_ch_wdata_0]
connect_bd_net [get_bd_pins axi_ad9680_adxcvr/up_ch_wdata_1] [get_bd_pins up_ch_wdata_1]
connect_bd_net [get_bd_pins axi_ad9680_adxcvr/up_ch_wdata_2] [get_bd_pins up_ch_wdata_2]
connect_bd_net [get_bd_pins axi_ad9680_adxcvr/up_ch_wdata_3] [get_bd_pins up_ch_wdata_3]
connect_bd_net [get_bd_pins axi_ad9680_adxcvr/up_ch_wr_0] [get_bd_pins up_ch_wr_0]
connect_bd_net [get_bd_pins axi_ad9680_adxcvr/up_ch_wr_1] [get_bd_pins up_ch_wr_1]
connect_bd_net [get_bd_pins axi_ad9680_adxcvr/up_ch_wr_2] [get_bd_pins up_ch_wr_2]
connect_bd_net [get_bd_pins axi_ad9680_adxcvr/up_ch_wr_3] [get_bd_pins up_ch_wr_3]
connect_bd_net [get_bd_pins axi_ad9680_adxcvr/up_es_addr_0] [get_bd_pins up_es_addr_0]
connect_bd_net [get_bd_pins axi_ad9680_adxcvr/up_es_addr_1] [get_bd_pins up_es_addr_1]
connect_bd_net [get_bd_pins axi_ad9680_adxcvr/up_es_addr_2] [get_bd_pins up_es_addr_2]
connect_bd_net [get_bd_pins axi_ad9680_adxcvr/up_es_addr_3] [get_bd_pins up_es_addr_3]
connect_bd_net [get_bd_pins axi_ad9680_adxcvr/up_es_enb_0] [get_bd_pins up_es_enb_0]
connect_bd_net [get_bd_pins axi_ad9680_adxcvr/up_es_enb_1] [get_bd_pins up_es_enb_1]
connect_bd_net [get_bd_pins axi_ad9680_adxcvr/up_es_enb_2] [get_bd_pins up_es_enb_2]
connect_bd_net [get_bd_pins axi_ad9680_adxcvr/up_es_enb_3] [get_bd_pins up_es_enb_3]
connect_bd_net [get_bd_pins axi_ad9680_adxcvr/up_es_reset_0] [get_bd_pins up_es_reset_0]
connect_bd_net [get_bd_pins axi_ad9680_adxcvr/up_es_reset_1] [get_bd_pins up_es_reset_1]
connect_bd_net [get_bd_pins axi_ad9680_adxcvr/up_es_reset_2] [get_bd_pins up_es_reset_2]
connect_bd_net [get_bd_pins axi_ad9680_adxcvr/up_es_reset_3] [get_bd_pins up_es_reset_3]
connect_bd_net [get_bd_pins axi_ad9680_adxcvr/up_es_wdata_0] [get_bd_pins up_es_wdata_0]
connect_bd_net [get_bd_pins axi_ad9680_adxcvr/up_es_wdata_1] [get_bd_pins up_es_wdata_1]
connect_bd_net [get_bd_pins axi_ad9680_adxcvr/up_es_wdata_2] [get_bd_pins up_es_wdata_2]
connect_bd_net [get_bd_pins axi_ad9680_adxcvr/up_es_wdata_3] [get_bd_pins up_es_wdata_3]
connect_bd_net [get_bd_pins axi_ad9680_adxcvr/up_es_wr_0] [get_bd_pins up_es_wr_0]
connect_bd_net [get_bd_pins axi_ad9680_adxcvr/up_es_wr_1] [get_bd_pins up_es_wr_1]
connect_bd_net [get_bd_pins axi_ad9680_adxcvr/up_es_wr_2] [get_bd_pins up_es_wr_2]
connect_bd_net [get_bd_pins axi_ad9680_adxcvr/up_es_wr_3] [get_bd_pins up_es_wr_3]
connect_bd_net [get_bd_pins axi_ad9680_adxcvr/up_pll_rst] [get_bd_pins up_pll_rst]
connect_bd_net [get_bd_pins s_axi_aclk] [get_bd_pins axi_ad9680_adxcvr/s_axi_aclk]
connect_bd_net [get_bd_pins s_axi_aresetn] [get_bd_pins axi_ad9680_adxcvr/s_axi_aresetn]
connect_bd_net -net up_ch_bufstatus_0_1 [get_bd_pins up_ch_bufstatus_0] [get_bd_pins axi_ad9680_adxcvr/up_ch_bufstatus_0]
connect_bd_net -net up_ch_bufstatus_1_1 [get_bd_pins up_ch_bufstatus_1] [get_bd_pins axi_ad9680_adxcvr/up_ch_bufstatus_1]
connect_bd_net -net up_ch_bufstatus_2_1 [get_bd_pins up_ch_bufstatus_2] [get_bd_pins axi_ad9680_adxcvr/up_ch_bufstatus_2]
connect_bd_net -net up_ch_bufstatus_3_1 [get_bd_pins up_ch_bufstatus_3] [get_bd_pins axi_ad9680_adxcvr/up_ch_bufstatus_3]
connect_bd_net -net up_ch_pll_locked_0_1 [get_bd_pins up_ch_pll_locked_0] [get_bd_pins axi_ad9680_adxcvr/up_ch_pll_locked_0]
connect_bd_net -net up_ch_pll_locked_1_1 [get_bd_pins up_ch_pll_locked_1] [get_bd_pins axi_ad9680_adxcvr/up_ch_pll_locked_1]
connect_bd_net -net up_ch_pll_locked_2_1 [get_bd_pins up_ch_pll_locked_2] [get_bd_pins axi_ad9680_adxcvr/up_ch_pll_locked_2]
connect_bd_net -net up_ch_pll_locked_3_1 [get_bd_pins up_ch_pll_locked_3] [get_bd_pins axi_ad9680_adxcvr/up_ch_pll_locked_3]
connect_bd_net -net up_ch_prbserr_0_1 [get_bd_pins up_ch_prbserr_0] [get_bd_pins axi_ad9680_adxcvr/up_ch_prbserr_0]
connect_bd_net -net up_ch_prbserr_1_1 [get_bd_pins up_ch_prbserr_1] [get_bd_pins axi_ad9680_adxcvr/up_ch_prbserr_1]
connect_bd_net -net up_ch_prbserr_2_1 [get_bd_pins up_ch_prbserr_2] [get_bd_pins axi_ad9680_adxcvr/up_ch_prbserr_2]
connect_bd_net -net up_ch_prbserr_3_1 [get_bd_pins up_ch_prbserr_3] [get_bd_pins axi_ad9680_adxcvr/up_ch_prbserr_3]
connect_bd_net -net up_ch_prbslocked_0_1 [get_bd_pins up_ch_prbslocked_0] [get_bd_pins axi_ad9680_adxcvr/up_ch_prbslocked_0]
connect_bd_net -net up_ch_prbslocked_1_1 [get_bd_pins up_ch_prbslocked_1] [get_bd_pins axi_ad9680_adxcvr/up_ch_prbslocked_1]
connect_bd_net -net up_ch_prbslocked_2_1 [get_bd_pins up_ch_prbslocked_2] [get_bd_pins axi_ad9680_adxcvr/up_ch_prbslocked_2]
connect_bd_net -net up_ch_prbslocked_3_1 [get_bd_pins up_ch_prbslocked_3] [get_bd_pins axi_ad9680_adxcvr/up_ch_prbslocked_3]
connect_bd_net -net up_ch_rdata_0_1 [get_bd_pins up_ch_rdata_0] [get_bd_pins axi_ad9680_adxcvr/up_ch_rdata_0]
connect_bd_net -net up_ch_rdata_1_1 [get_bd_pins up_ch_rdata_1] [get_bd_pins axi_ad9680_adxcvr/up_ch_rdata_1]
connect_bd_net -net up_ch_rdata_2_1 [get_bd_pins up_ch_rdata_2] [get_bd_pins axi_ad9680_adxcvr/up_ch_rdata_2]
connect_bd_net -net up_ch_rdata_3_1 [get_bd_pins up_ch_rdata_3] [get_bd_pins axi_ad9680_adxcvr/up_ch_rdata_3]
connect_bd_net -net up_ch_ready_0_1 [get_bd_pins up_ch_ready_0] [get_bd_pins axi_ad9680_adxcvr/up_ch_ready_0]
connect_bd_net -net up_ch_ready_1_1 [get_bd_pins up_ch_ready_1] [get_bd_pins axi_ad9680_adxcvr/up_ch_ready_1]
connect_bd_net -net up_ch_ready_2_1 [get_bd_pins up_ch_ready_2] [get_bd_pins axi_ad9680_adxcvr/up_ch_ready_2]
connect_bd_net -net up_ch_ready_3_1 [get_bd_pins up_ch_ready_3] [get_bd_pins axi_ad9680_adxcvr/up_ch_ready_3]
connect_bd_net -net up_ch_rst_done_0_1 [get_bd_pins up_ch_rst_done_0] [get_bd_pins axi_ad9680_adxcvr/up_ch_rst_done_0]
connect_bd_net -net up_ch_rst_done_1_1 [get_bd_pins up_ch_rst_done_1] [get_bd_pins axi_ad9680_adxcvr/up_ch_rst_done_1]
connect_bd_net -net up_ch_rst_done_2_1 [get_bd_pins up_ch_rst_done_2] [get_bd_pins axi_ad9680_adxcvr/up_ch_rst_done_2]
connect_bd_net -net up_ch_rst_done_3_1 [get_bd_pins up_ch_rst_done_3] [get_bd_pins axi_ad9680_adxcvr/up_ch_rst_done_3]
connect_bd_net -net up_es_rdata_0_1 [get_bd_pins up_es_rdata_0] [get_bd_pins axi_ad9680_adxcvr/up_es_rdata_0]
connect_bd_net -net up_es_rdata_1_1 [get_bd_pins up_es_rdata_1] [get_bd_pins axi_ad9680_adxcvr/up_es_rdata_1]
connect_bd_net -net up_es_rdata_2_1 [get_bd_pins up_es_rdata_2] [get_bd_pins axi_ad9680_adxcvr/up_es_rdata_2]
connect_bd_net -net up_es_rdata_3_1 [get_bd_pins up_es_rdata_3] [get_bd_pins axi_ad9680_adxcvr/up_es_rdata_3]
connect_bd_net -net up_es_ready_0_1 [get_bd_pins up_es_ready_0] [get_bd_pins axi_ad9680_adxcvr/up_es_ready_0]
connect_bd_net -net up_es_ready_1_1 [get_bd_pins up_es_ready_1] [get_bd_pins axi_ad9680_adxcvr/up_es_ready_1]
connect_bd_net -net up_es_ready_2_1 [get_bd_pins up_es_ready_2] [get_bd_pins axi_ad9680_adxcvr/up_es_ready_2]
connect_bd_net -net up_es_ready_3_1 [get_bd_pins up_es_ready_3] [get_bd_pins axi_ad9680_adxcvr/up_es_ready_3]
